# Altium project MB1261.PrjPcb (part 2 of 3)

## Sheet MCU.SchDoc: MCU
size A3; Author: P.A.; CompanyName: STMicroelectronics; Organization: Microcontrollers Division; Address1: 12, Rue Jules HOROWITZ; Address2: 38019 Grenoble; Address3: FRANCE; DocumentNumber: MB1261; Revision: B.01; SheetNumber: 11; SheetTotal: 15; Project: STM32L496G-DISCO
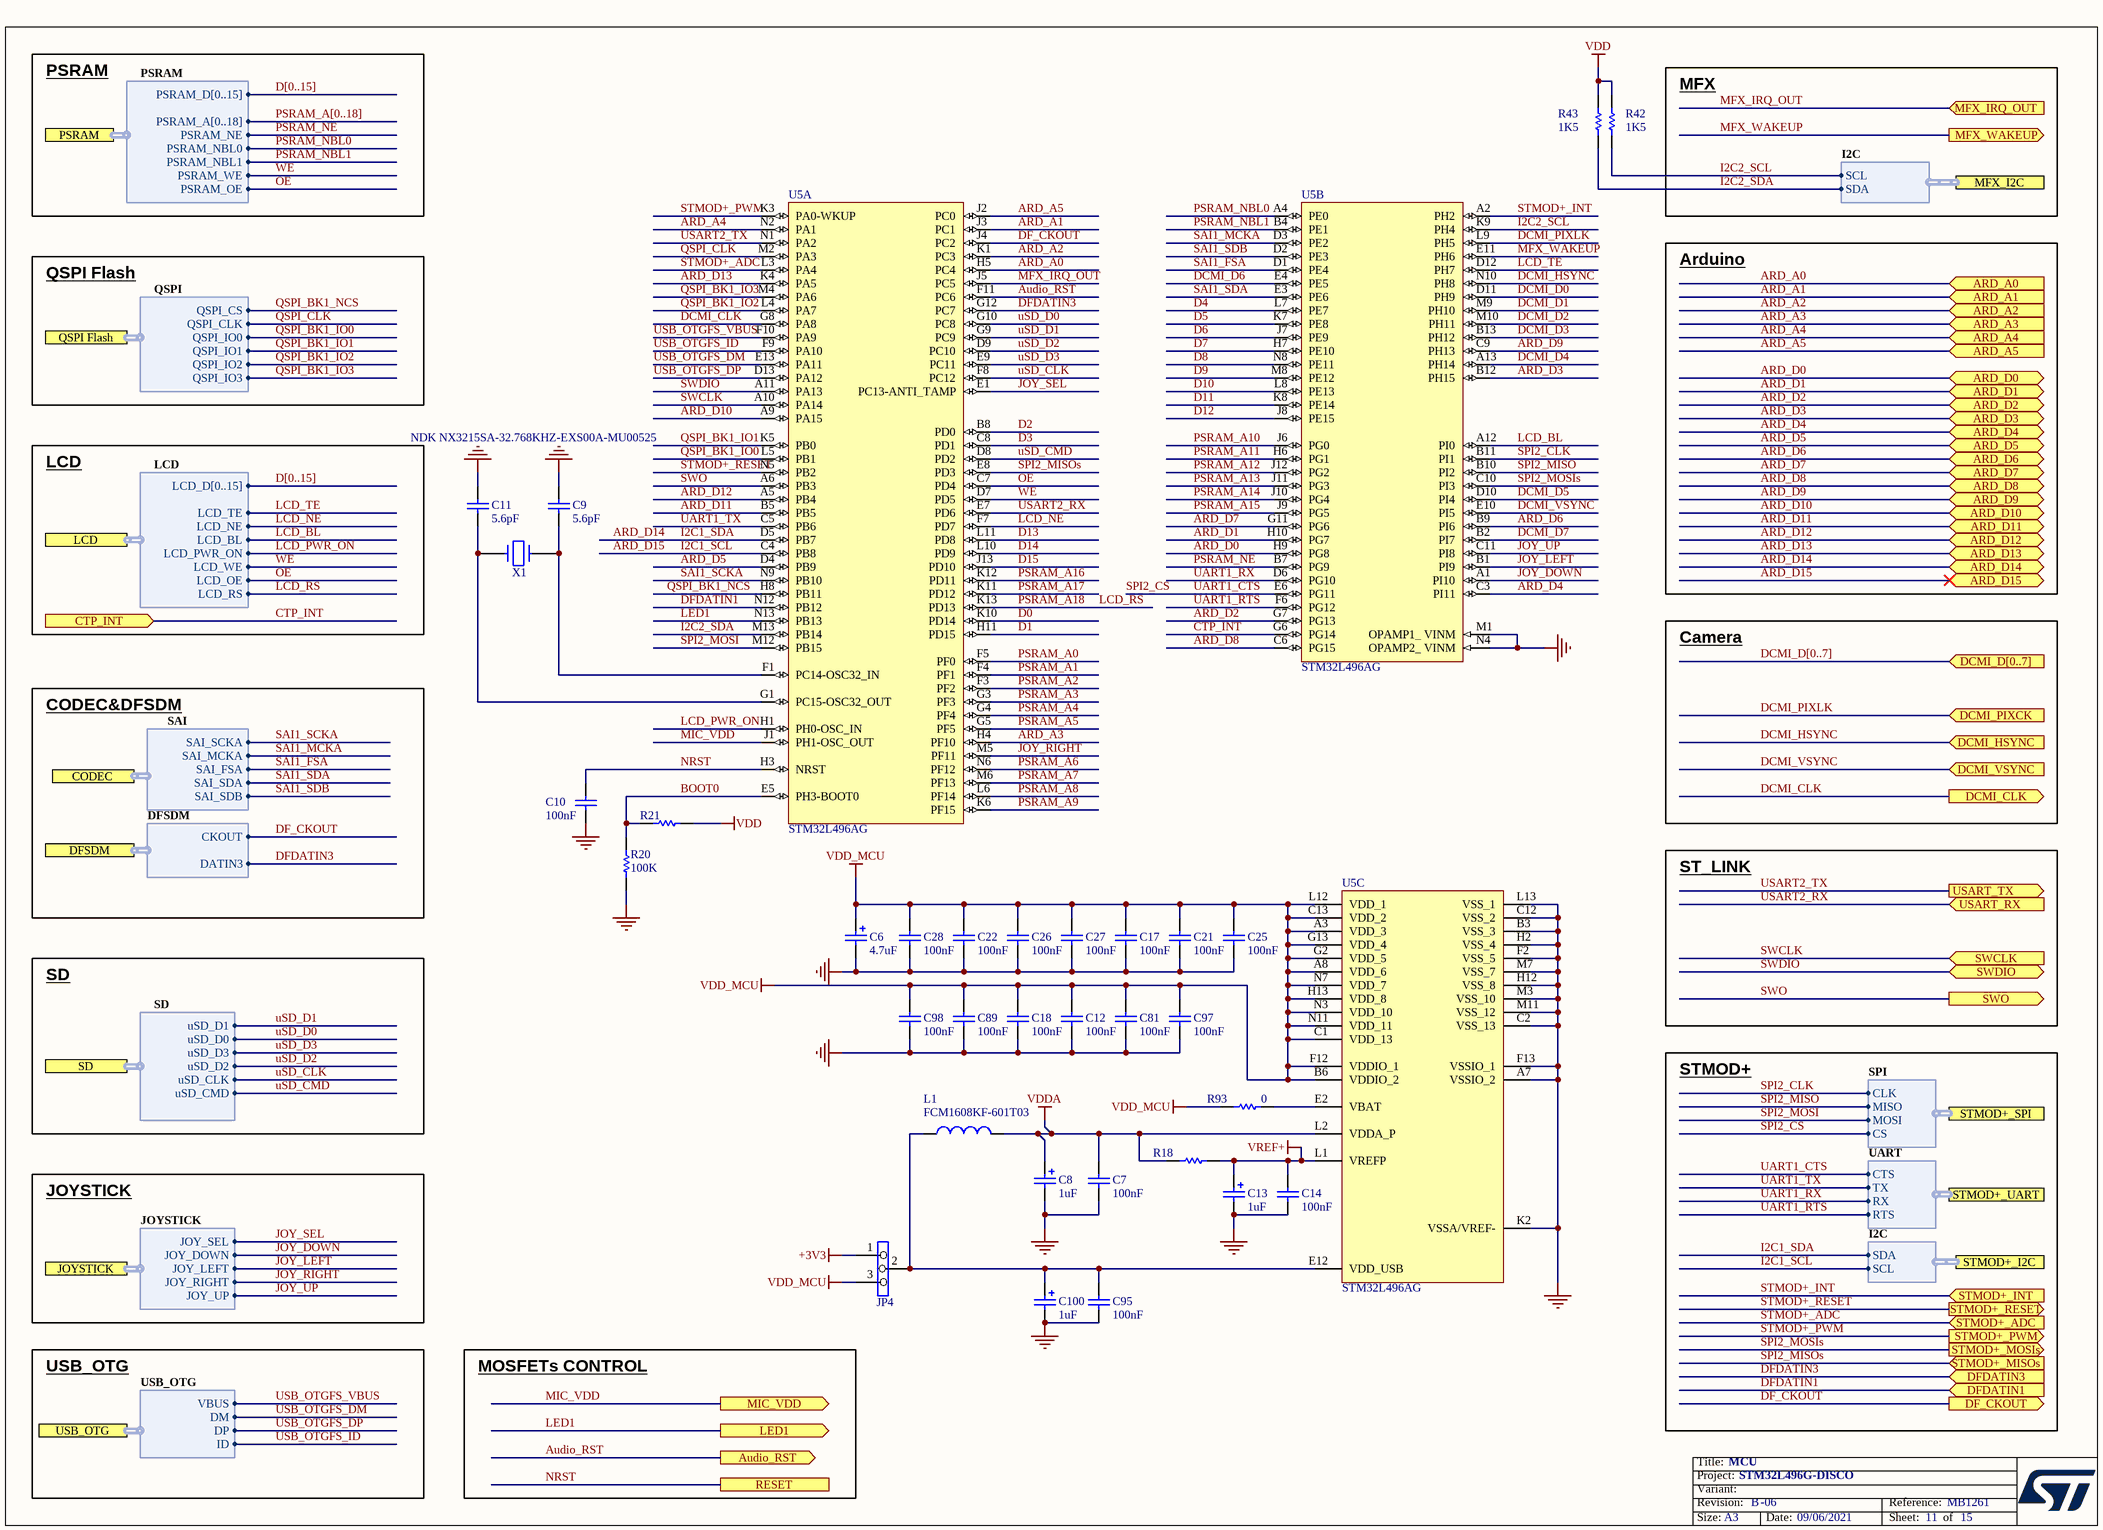
[diagram p6: MCU.SchDoc]

### Parts
C6  value 4.7uF  [TAN-A]  (hidden comment: TAJA475K016R)
C7  value 100nF  [0603C]  (hidden comment: CC0603KRX7R7BB104)
C8  value 1uF  [TAN-A]  (hidden comment: TAJA105K016R)
C9  5.6pF  [0603C]
C10  value 100nF  [0603C]  (hidden comment: CC0603KRX7R7BB104)
C11  5.6pF  [0603C]
C12  value 100nF  [0603C]  (hidden comment: CC0603KRX7R7BB104)
C13  value 1uF  [TAN-A]  (hidden comment: TAJA105K016R)
C14  value 100nF  [0603C]  (hidden comment: CC0603KRX7R7BB104)
C17  value 100nF  [0603C]  (hidden comment: CC0603KRX7R7BB104)
C18  value 100nF  [0603C]  (hidden comment: CC0603KRX7R7BB104)
C21  value 100nF  [0603C]  (hidden comment: CC0603KRX7R7BB104)
C22  value 100nF  [0603C]  (hidden comment: CC0603KRX7R7BB104)
C25  value 100nF  [0603C]  (hidden comment: CC0603KRX7R7BB104)
C26  value 100nF  [0603C]  (hidden comment: CC0603KRX7R7BB104)
C27  value 100nF  [0603C]  (hidden comment: CC0603KRX7R7BB104)
C28  value 100nF  [0603C]  (hidden comment: CC0603KRX7R7BB104)
C81  value 100nF  [0603C]  (hidden comment: CC0603KRX7R7BB104)
C89  value 100nF  [0603C]  (hidden comment: CC0603KRX7R7BB104)
C95  value 100nF  [0603C]  (hidden comment: CC0603KRX7R7BB104)
C97  value 100nF  [0603C]  (hidden comment: CC0603KRX7R7BB104)
C98  value 100nF  [0603C]  (hidden comment: CC0603KRX7R7BB104)
C100  value 1uF  [TAN-A]  (hidden comment: TAJA105K016R)
JP4  Jumper3  [SIP3]  (value not drawn)
L1  FCM1608KF-601T03  [0603L]
R18  (no value)  [0603R]
R20  value 100K  [0603R]  (hidden comment: RC0603FR-07100KL)
R21  (no value)  [0603R]
R42  value 1K5  [0603R]  (hidden comment: RC0603FR-071K5L)
R43  value 1K5  [0603R]  (hidden comment: RC0603FR-071K5L)
R93  value 0  [0603R]  (hidden comment: RC0603JR-070RL)
U5  STM32L496AG  [FBGA169_0R5_7X7]  (parts A,B,C of 3)
X1  NDK NX3215SA-32.768KHZ-EXS00A-MU00525  [XTAL_2SM_3R2X1R5]

### Ports
ARD_A0 (in), ARD_A1 (in), ARD_A2 (in), ARD_A3 (in), ARD_A4 (in), ARD_A5 (in), ARD_D0 (bidir), ARD_D1 (bidir), ARD_D2 (bidir), ARD_D3 (bidir), ARD_D4 (bidir), ARD_D5 (bidir), ARD_D6 (bidir), ARD_D7 (bidir), ARD_D8 (bidir), ARD_D9 (bidir), ARD_D10 (bidir), ARD_D11 (bidir), ARD_D12 (bidir), ARD_D13 (bidir), ARD_D14 (bidir), ARD_D15 (bidir), Audio_RST (out), CODEC (harness SAI), CTP_INT (in), DCMI_CLK (out), DCMI_D[0..7] (in), DCMI_HSYNC (in), DCMI_PIXCK (in), DCMI_VSYNC (in), DF_CKOUT (out), DFDATIN1 (in), DFDATIN3 (in), DFSDM (harness DFSDM), JOYSTICK (harness JOYSTICK), LCD (harness LCD), LED1 (out), MFX_I2C (harness I2C), MFX_IRQ_OUT (in), MFX_WAKEUP (out), MIC_VDD (out), PSRAM (harness PSRAM), QSPI Flash (harness QSPI), RESET, SD (harness SD), STMOD+_ADC (in), STMOD+_I2C (harness I2C), STMOD+_INT (in), STMOD+_MISOs (in), STMOD+_MOSIs (out), STMOD+_PWM (out), STMOD+_RESET (out), STMOD+_SPI (harness SPI), STMOD+_UART (harness UART), SWCLK (in), SWDIO (bidir), SWO (out), USART_RX (in), USART_TX (out), USB_OTG (harness USB_OTG)

### Harnesses
QSPI: QSPI_IO1, QSPI_IO0, QSPI_CLK, QSPI_CS, QSPI_IO2, QSPI_IO3
PSRAM: PSRAM_A[0..18], PSRAM_NE, PSRAM_NBL0, PSRAM_WE, PSRAM_OE, PSRAM_D[0..15], PSRAM_NBL1
LCD: LCD_NE, LCD_BL, LCD_WE, LCD_OE, LCD_D[0..15], LCD_RS, LCD_PWR_ON, LCD_TE
SAI: SAI_SDB, SAI_FSA, SAI_MCKA, SAI_SDA, SAI_SCKA
DFSDM: DATIN3, CKOUT
SD: uSD_D0, uSD_CLK, uSD_D1, uSD_D2, uSD_D3, uSD_CMD
JOYSTICK: JOY_SEL, JOY_DOWN, JOY_LEFT, JOY_RIGHT, JOY_UP
USB_OTG: VBUS, DM, DP, ID
I2C: SDA, SCL
SPI: MISO, MOSI, CLK, CS
UART: RX, TX, RTS, CTS

### Nets
+3V3: JP4.1  [project net 3V3_OUT]
GND: C6.2 C7.2 C8.2 C9.1 C10.2 C11.1 C12.2 C13.2 C14.2 C17.2 C18.2 C21.2 C22.2 C25.2 C26.2 C27.2 C28.2 C81.2 C89.2 C95.2 C97.2 C98.2 C100.2 R20.1 U5.A7(VSSIO_2) U5.B3(VSS_3) U5.C2(VSS_13) U5.C12(VSS_2) U5.F2(VSS_5) U5.F13(VSSIO_1) U5.H2(VSS_4) U5.H12(VSS_8) U5.K2(VSSA/VREF-) U5.L13(VSS_1) U5.M1(OPAMP1__VINM) U5.M3(VSS_10) U5.M7(VSS_7) U5.M11(VSS_12) U5.N4(OPAMP2__VINM)
VDD: R21.1 R42.1 R43.1
VDD_MCU: C6.1 C12.1 C17.1 C18.1 C21.1 C22.1 C25.1 C26.1 C27.1 C28.1 C81.1 C89.1 C97.1 C98.1 JP4.3 R93.2 U5.A3(VDD_3) U5.A8(VDD_6) U5.B6(VDDIO_2) U5.C1(VDD_13) U5.C13(VDD_2) U5.F12(VDDIO_1) U5.G2(VDD_5) U5.G13(VDD_4) U5.H13(VDD_8) U5.L12(VDD_1) U5.N3(VDD_10) U5.N7(VDD_7) U5.N11(VDD_11)
VDDA: C7.1 C8.1 L1.2 R18.2 U5.L2(VDDA_P)
VREF+: C13.1 C14.1 R18.1 U5.L1(VREFP)
ARD_A0: U5.H5(PC4) ; port ARD_A0
ARD_A1: U5.J3(PC1) ; port ARD_A1
ARD_A2: U5.K1(PC3) ; port ARD_A2
ARD_A3: U5.H4(PF10) ; port ARD_A3
ARD_A4: U5.N2(PA1) ; port ARD_A4
ARD_A5: U5.J2(PC0) ; port ARD_A5
ARD_D0: U5.H9(PG8) ; port ARD_D0
ARD_D1: U5.H10(PG7) ; port ARD_D1
ARD_D2: U5.G7(PG13) ; port ARD_D2
ARD_D3: U5.B12(PH15) ; port ARD_D3
ARD_D4: U5.C3(PI11) ; port ARD_D4
ARD_D5: U5.D4(PB9) ; port ARD_D5
ARD_D6: U5.B9(PI6) ; port ARD_D6
ARD_D7: U5.G11(PG6) ; port ARD_D7
ARD_D8: U5.C6(PG15) ; port ARD_D8
ARD_D9: U5.C9(PH13) ; port ARD_D9
ARD_D10: U5.A9(PA15) ; port ARD_D10
ARD_D11: U5.B5(PB5) ; port ARD_D11
ARD_D12: U5.A5(PB4) ; port ARD_D12
ARD_D13: U5.K4(PA5) ; port ARD_D13
ARD_D14: U5.D5(PB7) ; port ARD_D14, port STMOD+_I2C.SDA  [also labelled I2C1_SDA]
ARD_D15: U5.C4(PB8) ; port ARD_D15, port STMOD+_I2C.SCL  [also labelled I2C1_SCL]
Audio_RST: U5.F11(PC6) ; port Audio_RST
BOOT0: R20.2 R21.2 U5.E5(PH3-BOOT0)
CTP_INT: U5.G6(PG14) ; port CTP_INT
D0: U5.K10(PD14)
D1: U5.H11(PD15)
D2: U5.B8(PD0)
D3: U5.C8(PD1)
D4: U5.L7(PE7)
D5: U5.K7(PE8)
D6: U5.J7(PE9)
D7: U5.H7(PE10)
D8: U5.N8(PE11)
D9: U5.M8(PE12)
D10: U5.L8(PE13)
D11: U5.K8(PE14)
D12: U5.J8(PE15)
D13: U5.L11(PD8)
D14: U5.L10(PD9)
D15: U5.J13(PD10)
DCMI_CLK: U5.G8(PA8) ; port DCMI_CLK
DCMI_D0: U5.D11(PH9)
DCMI_D1: U5.M9(PH10)
DCMI_D2: U5.M10(PH11)
DCMI_D3: U5.B13(PH12)
DCMI_D4: U5.A13(PH14)
DCMI_D5: U5.D10(PI4)
DCMI_D6: U5.E4(PE5)
DCMI_D7: U5.B2(PI7)
DCMI_HSYNC: U5.N10(PH8) ; port DCMI_HSYNC
DCMI_PIXLK: U5.L9(PH5) ; port DCMI_PIXCK  [project net DCMI_PIXCK]
DCMI_VSYNC: U5.E10(PI5) ; port DCMI_VSYNC
DF_CKOUT: U5.J4(PC2) ; port DF_CKOUT, port DFSDM.CKOUT  [project net CKOUT]
DFDATIN1: U5.N12(PB12) ; port DFDATIN1
DFDATIN3: U5.G12(PC7) ; port DFDATIN3, port DFSDM.DATIN3  [project net DATIN3]
I2C2_SCL: R42.2 U5.K9(PH4) ; port MFX_I2C.SCL
I2C2_SDA: R43.2 U5.M13(PB14) ; port MFX_I2C.SDA
JOY_DOWN: U5.A1(PI10) ; port JOYSTICK.JOY_DOWN
JOY_LEFT: U5.B1(PI9) ; port JOYSTICK.JOY_LEFT
JOY_RIGHT: U5.M5(PF11) ; port JOYSTICK.JOY_RIGHT
JOY_SEL: U5.E1(PC13-ANTI_TAMP) ; port JOYSTICK.JOY_SEL
JOY_UP: U5.C11(PI8) ; port JOYSTICK.JOY_UP
LCD_BL: U5.A12(PI0) ; port LCD.LCD_BL
LCD_NE: U5.F7(PD7) ; port LCD.LCD_NE
LCD_PWR_ON: U5.H1(PH0-OSC_IN) ; port LCD.LCD_PWR_ON
LCD_RS: U5.K13(PD13) ; port LCD.LCD_RS  [also labelled PSRAM_A18]
LCD_TE: U5.D12(PH7) ; port LCD.LCD_TE
LED1: U5.N13(PB13) ; port LED1
MFX_IRQ_OUT: U5.J5(PC5) ; port MFX_IRQ_OUT
MFX_WAKEUP: U5.E11(PH6) ; port MFX_WAKEUP
MIC_VDD: U5.J1(PH1-OSC_OUT) ; port MIC_VDD
NRST: C10.1 U5.H3(NRST) ; port RESET
OE: U5.C7(PD4) ; port PSRAM.PSRAM_OE, port LCD.LCD_OE  [project net LCD_OE]
PSRAM_A0: U5.F5(PF0)
PSRAM_A1: U5.F4(PF1)
PSRAM_A2: U5.F3(PF2)
PSRAM_A3: U5.G3(PF3)
PSRAM_A4: U5.G4(PF4)
PSRAM_A5: U5.G5(PF5)
PSRAM_A6: U5.N6(PF12)
PSRAM_A7: U5.M6(PF13)
PSRAM_A8: U5.L6(PF14)
PSRAM_A9: U5.K6(PF15)
PSRAM_A10: U5.J6(PG0)
PSRAM_A11: U5.H6(PG1)
PSRAM_A12: U5.J12(PG2)
PSRAM_A13: U5.J11(PG3)
PSRAM_A14: U5.J10(PG4)
PSRAM_A15: U5.J9(PG5)
PSRAM_A16: U5.K12(PD11)
PSRAM_A17: U5.K11(PD12)
PSRAM_NBL0: U5.A4(PE0) ; port PSRAM.PSRAM_NBL0
PSRAM_NBL1: U5.B4(PE1) ; port PSRAM.PSRAM_NBL1
PSRAM_NE: U5.B7(PG9) ; port PSRAM.PSRAM_NE
QSPI_BK1_IO0: U5.L5(PB1) ; port QSPI Flash.QSPI_IO0
QSPI_BK1_IO1: U5.K5(PB0) ; port QSPI Flash.QSPI_IO1
QSPI_BK1_IO2: U5.L4(PA7) ; port QSPI Flash.QSPI_IO2
QSPI_BK1_IO3: U5.M4(PA6) ; port QSPI Flash.QSPI_IO3
QSPI_BK1_NCS: U5.H8(PB11) ; port QSPI Flash.QSPI_CS
QSPI_CLK: U5.M2(PA3) ; port QSPI Flash.QSPI_CLK
SAI1_FSA: U5.D1(PE4) ; port CODEC.SAI_FSA
SAI1_MCKA: U5.D3(PE2) ; port CODEC.SAI_MCKA
SAI1_SCKA: U5.N9(PB10) ; port CODEC.SAI_SCKA
SAI1_SDA: U5.E3(PE6) ; port CODEC.SAI_SDA
SAI1_SDB: U5.D2(PE3) ; port CODEC.SAI_SDB
SPI2_CLK: U5.B11(PI1) ; port STMOD+_SPI.CLK
SPI2_CS: U5.E6(PG11) ; port STMOD+_SPI.CS, port STMOD+_UART.CTS  [also labelled UART1_CTS]  [project net PMOD#1]
SPI2_MISO: U5.B10(PI2) ; port STMOD+_SPI.MISO
SPI2_MISOs: U5.E8(PD3) ; port STMOD+_MISOs
SPI2_MOSI: U5.M12(PB15) ; port STMOD+_SPI.MOSI
SPI2_MOSIs: U5.C10(PI3) ; port STMOD+_MOSIs
STMOD+_ADC: U5.L3(PA4) ; port STMOD+_ADC
STMOD+_INT: U5.A2(PH2) ; port STMOD+_INT  [project net PMOD#11]
STMOD+_PWM: U5.K3(PA0-WKUP) ; port STMOD+_PWM
STMOD+_RESET: U5.N5(PB2) ; port STMOD+_RESET  [project net PMOD#12]
SWCLK: U5.A10(PA14) ; port SWCLK
SWDIO: U5.A11(PA13) ; port SWDIO
SWO: U5.A6(PB3) ; port SWO
UART1_RTS: U5.F6(PG12) ; port STMOD+_UART.RTS
UART1_RX: U5.D6(PG10) ; port STMOD+_UART.RX
UART1_TX: U5.C5(PB6) ; port STMOD+_UART.TX
USART2_RX: U5.E7(PD6) ; port USART_RX
USART2_TX: U5.N1(PA2) ; port USART_TX
USB_OTGFS_DM: U5.E13(PA11) ; port USB_OTG.DM  [project net D_N]
USB_OTGFS_DP: U5.D13(PA12) ; port USB_OTG.DP  [project net D_P]
USB_OTGFS_ID: U5.F9(PA10) ; port USB_OTG.ID
USB_OTGFS_VBUS: U5.F10(PA9) ; port USB_OTG.VBUS
uSD_CLK: U5.F8(PC12) ; port SD.uSD_CLK
uSD_CMD: U5.D8(PD2) ; port SD.uSD_CMD
uSD_D0: U5.G10(PC8) ; port SD.uSD_D0
uSD_D1: U5.G9(PC9) ; port SD.uSD_D1
uSD_D2: U5.D9(PC10) ; port SD.uSD_D2
uSD_D3: U5.E9(PC11) ; port SD.uSD_D3
WE: U5.D7(PD5) ; port PSRAM.PSRAM_WE, port LCD.LCD_WE  [project net LCD_WE]
NetC9_2: C9.2 U5.F1(PC14-OSC32_IN) X1.1
NetC11_2: C11.2 U5.G1(PC15-OSC32_OUT) X1.2
NetC95_1: C95.1 C100.1 JP4.2 L1.1 U5.E12(VDD_USB)
NetR93_1: R93.1 U5.E2(VBAT)

### Buses and harness runs
bus D[0..15]
bus DCMI_D[0..7] = port DCMI_D[0..7]
bus PSRAM_A[0..18]

### Notes on the sheet
- PSRAM
- MFX
- Arduino
- QSPI Flash
- LCD
- Camera
- CODEC&DFSDM
- ST_LINK
- SD
- STMOD+
- JOYSTICK
- USB_OTG
- MOSFETs CONTROL
- Title:
- Project:
- Size:
- Revision:
- Variant:
- A3
- -
- Date:
- Reference:
- Sheet:
- of

### Library data of the parts
C6 = Cap Pol1: TAN Capacitor,4.7uF,10%,16V,A Type,AVX; Ordered by: Subcon; ECCN_US/EU: NA; Published: 8-Jun-2000; Revision: July-2002: Re-released for DXP Platform.; Publisher: Altium Limited; Manuf_1: AVX; Manuf_Part_1: TAJA475K016R
C7 C10 C12 C14 C17 C18 C21 C22 C25-C28 C81 C89 C95 C97 C98 = Cap: as C60 on sheet Camera; Published: 8-Jun-2000; Revision: July-2002: Re-released for DXP Platform.; Publisher: Altium Limited; Manuf_1: YAGEO; Manuf_Part_1: CC0603KRX7R7BB104
C8 C13 C100 = Cap Pol1: Tan Capacitor,1uF,10%,16V,Tan-A,TAJA105K016R; Manuf_1: AVX; Ordered by: Subcon; ECCN_US/EU: NA; Published: 8-Jun-2000; Revision: July-2002: Re-released for DXP Platform.; Publisher: Altium Limited; Manuf_Part_1: TAJA105K016R
C9 C11 = Cap: Capacitor,5.6pF,0.25P,50V,NPO,0603; Manuf_1: YAGEO; Ordered by: Subcon; Published: 8-Jun-2000; Revision: July-2002: Re-released for DXP Platform.; Publisher: Altium Limited; Value: 5.6pF
JP4 = Jumper3: Manuf_1: lyconn; Manuf_Part_1: 313103S111116; Ordered by: Subcon; ECCN_US/EU: NA
L1 = Inductor: 100uH Bead; Manuf_1: Tai-tech; Ordered by: Subcon; ECCN_US/EU: NA; Published: 8-Jun-2000; Revision: July-2002: Re-released for DXP Platform.; Publisher: Altium Limited; Value: 100uH; Manuf_Part_1: FCM1608KF-601T03
R18 = res1: Resistor, 0 ,0603,1%,YAGEO; Manuf_Part_1: RC0603JR-070RL; Value: 0; Ordered by: Subcon; ECCN_US/EU: NA; Published: 8-Jun-2000; Revision: July-2002: Re-released for DXP Platform.; Publisher: Altium Limited; Manuf_1: YAGEO
R20 = res1: as R84 on sheet IDD_measurement; Published: 8-Jun-2000; Revision: July-2002: Re-released for DXP Platform.; Publisher: Altium Limited; Manuf_1: YAGEO; Manuf_Part_1: RC0603FR-07100KL
R21 = res1: Resistor,100K,0603,1%,YAGEO; Manuf_Part_1: RC0603FR-07100KL; Ordered by: Subcon; ECCN_US/EU: NA; Published: 8-Jun-2000; Revision: July-2002: Re-released for DXP Platform.; Publisher: Altium Limited; Value: 100K; Manuf_1: YAGEO
R42 R43 = res1: Resistor,1.5K,0603,1%,YAGEO; Ordered by: Subcon; ECCN_US/EU: NA; Published: 8-Jun-2000; Revision: July-2002: Re-released for DXP Platform.; Publisher: Altium Limited; Manuf_1: YAGEO; Manuf_Part_1: RC0603FR-071K5L
R93 = res1: as R105 on sheet IDD_measurement; Published: 8-Jun-2000; Revision: July-2002: Re-released for DXP Platform.; Publisher: Altium Limited; Manuf_1: YAGEO; Manuf_Part_1: RC0603JR-070RL
U5 = STM32L496G: Ordered by: STM; Ref St: TBD; ECCN_US/EU: 3A991A2/NEC; Manuf_1: STM; Manuf_Part_1: STM32L496AG
X1 = CRYSTAL_32K: 32.768kHz Crystal; Ordered by: STM; ECCN_US/EU: EAR99/NEC; Ref St: 9157034; Manuf_1: NDK; Manuf_Part_1: NX3215SA-32.768KHZ-EXS00A-MU00525

## Sheet Peripherals.SchDoc: Peripherals
size A4; Author: P.A.; CompanyName: STMicroelectronics; Organization: Microcontrollers Division; Address1: 12, Rue Jules HOROWITZ; Address2: 38019 Grenoble; Address3: FRANCE; DocumentNumber: MB1261; Revision: B.01; SheetNumber: 7; SheetTotal: 15; Project: STM32L496G-DISCO
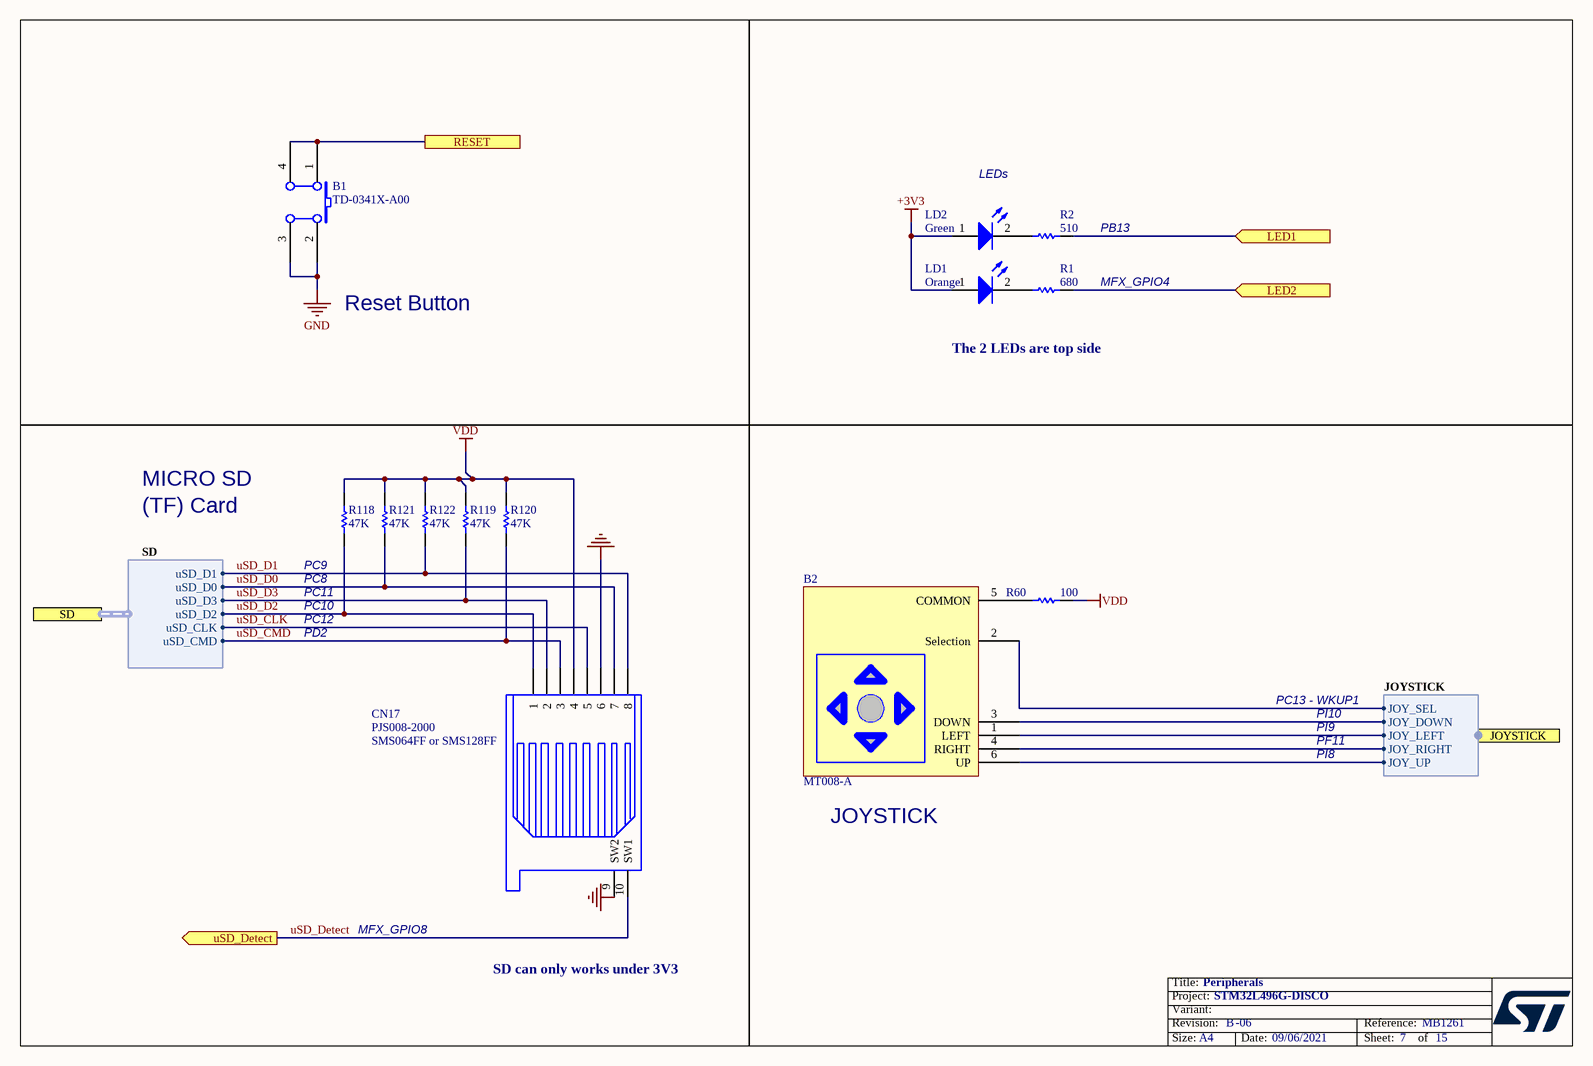
[diagram p7: Peripherals.SchDoc]

### Parts
B1  TD-0341X-A00  [PB10]
B2  MT008-A  [MT-008A]
CN17  PJS008-2000  [MSD_PJS008_]
LD1  Corlor: Orange  [0603D]  (hidden comment: 19-217/S2C-AM2N2VY/3T)
LD2  Corlor: Green  [0603D]  (hidden comment: 19-213SY6C/S530-E2/TR8LED)
R1  value 680  [0603R]  (hidden comment: RC0603FR-07680RL)
R2  value 510  [0603R]  (hidden comment: RC0603FR-07510RL)
R60  value 100  [0603R]  (hidden comment: RC0603JR-07100RL)
R118  47K  [0603R]
R119  47K  [0603R]
R120  47K  [0603R]
R121  47K  [0603R]
R122  47K  [0603R]

### Ports
JOYSTICK (harness JOYSTICK), LED1 (in), LED2 (in), RESET, SD (harness SD), uSD_Detect (out)

### Harnesses
SD: uSD_D0, uSD_CLK, uSD_D1, uSD_D2, uSD_D3, uSD_CMD
JOYSTICK: JOY_SEL, JOY_DOWN, JOY_LEFT, JOY_RIGHT, JOY_UP

### Nets
+3V3: LD1.1(A) LD2.1(A)  [project net 3V3_OUT]
GND: B1.2(B0) B1.3(B1) CN17.6 CN17.9(SW2)
VDD: CN17.4 R60.1 R118.2 R119.2 R120.2 R121.2 R122.2
JOY_DOWN: B2.3(DOWN) ; port JOYSTICK.JOY_DOWN
JOY_LEFT: B2.1(LEFT) ; port JOYSTICK.JOY_LEFT
JOY_RIGHT: B2.4(RIGHT) ; port JOYSTICK.JOY_RIGHT
JOY_SEL: B2.2(Selection) ; port JOYSTICK.JOY_SEL
JOY_UP: B2.6(UP) ; port JOYSTICK.JOY_UP
LED1: R2.1 ; port LED1
NRST: B1.1(A0) B1.4(A1) ; port RESET
uSD_CLK: CN17.5 ; port SD.uSD_CLK
uSD_CMD: CN17.3 R120.1 ; port SD.uSD_CMD
uSD_D0: CN17.7 R121.1 ; port SD.uSD_D0
uSD_D1: CN17.8 R122.1 ; port SD.uSD_D1
uSD_D2: CN17.1 R118.1 ; port SD.uSD_D2
uSD_D3: CN17.2 R119.1 ; port SD.uSD_D3
uSD_Detect: CN17.10(SW1) ; port uSD_Detect
NetB2_5: B2.5(COMMON) R60.2
NetLD1_2: LD1.2(K) R1.2
NetLD2_2: LD2.2(K) R2.2
NetR1_1: R1.1 ; port LED2

### Notes on the sheet
- LEDs
- (near R2) PB13
- Reset Button
- MFX_GPIO4
- The 2 LEDs are top side
- MICRO SD
- (TF) Card
- (near R118) PC8
- (near R118) PC9
- PC11
- PC10
- PC12
- PD2
- PC13 - WKUP1
- PI9
- PI10
- (near CN17) SMS064FF or SMS128FF
- PF11
- PI8
- JOYSTICK
- MFX_GPIO8
- SD can only works under 3V3
- Title:
- Project:
- Size:
- Revision:
- Variant:
- A4
- -
- Date:
- Reference:
- Sheet:
- of

### Library data of the parts
B1 = SW PUSHBUTTON: SE Push Button TD-0341 [RESET/Black]; Manuf_1: Chau-hua; Manuf_Part_1: CTSM-644N-V-T/R; Manuf_2: wealthmetal; Ordered by: Subcon; Assembly: with Back cap; Silkscreen: RESET; ECCN_US/EU: NA; Manuf_Part_2: TD-0341X-A00
B2 = MT-008A: Joystick; Manuf_1: XIEJIA; Ordered by: Subcon; Assembly: with button; ECCN_US/EU: NA; Silkscreen: Joystick; Manuf_Part_1: MT008-A
CN17 = SMS016AFA5E: Manuf_1: Yamaichi; Ordered by: Subcon; Silkscreen: uSD; ECCN_US/EU: NA; Manuf_Part_1: PJS008-2000
LD1 = LED2: LED,Orange,0603; Manuf_1: Everlight; Ordered by: Subcon; ECCN_US/EU: EAR99/NEC; Published: 8-Jun-2000; Revision: July-2002: Re-released for DXP Platform.; Publisher: Altium Limited; Manuf_Part_1: 19-217/S2C-AM2N2VY/3T
LD2 = LED2: as LD3 on sheet Arduino_ Connectors; Published: 8-Jun-2000; Revision: July-2002: Re-released for DXP Platform.; Publisher: Altium Limited; Manuf_Part_1: 19-213SY6C/S530-E2/TR8LED
R1 = res1: Resistor,680R,0603,1%,YAGEO; Ordered by: Subcon; ECCN_US/EU: NA; Published: 8-Jun-2000; Revision: July-2002: Re-released for DXP Platform.; Publisher: Altium Limited; Manuf_1: YAGEO; Manuf_Part_1: RC0603FR-07680RL
R2 = res1: Resistor,510R,0603,1%,YAGEO; Ordered by: Subcon; ECCN_US/EU: NA; Published: 8-Jun-2000; Revision: July-2002: Re-released for DXP Platform.; Publisher: Altium Limited; Manuf_1: YAGEO; Manuf_Part_1: RC0603FR-07510RL
R60 = res1: as R102 on sheet IDD_measurement; Published: 8-Jun-2000; Revision: July-2002: Re-released for DXP Platform.; Publisher: Altium Limited; Manuf_1: YAGEO; Manuf_Part_1: RC0603JR-07100RL
R118-R122 = res1: Resistor,47K,0603,1%,YAGEO; Manuf_Part_1: RC0603FR-0747KL; Ordered by: Subcon; ECCN_US/EU: NA; Published: 8-Jun-2000; Revision: July-2002: Re-released for DXP Platform.; Publisher: Altium Limited; Value: 47K; Manuf_1: YAGEO

## Sheet Power.SchDoc: Power
size A4; Author: P.A.; CompanyName: STMicroelectronics; Organization: Microcontrollers Division; Address1: 12, Rue Jules HOROWITZ; Address2: 38019 Grenoble; Address3: FRANCE; DocumentNumber: MB1261; Revision: B.01; SheetNumber: 3; SheetTotal: 15; Project: STM32L496G-DISCO
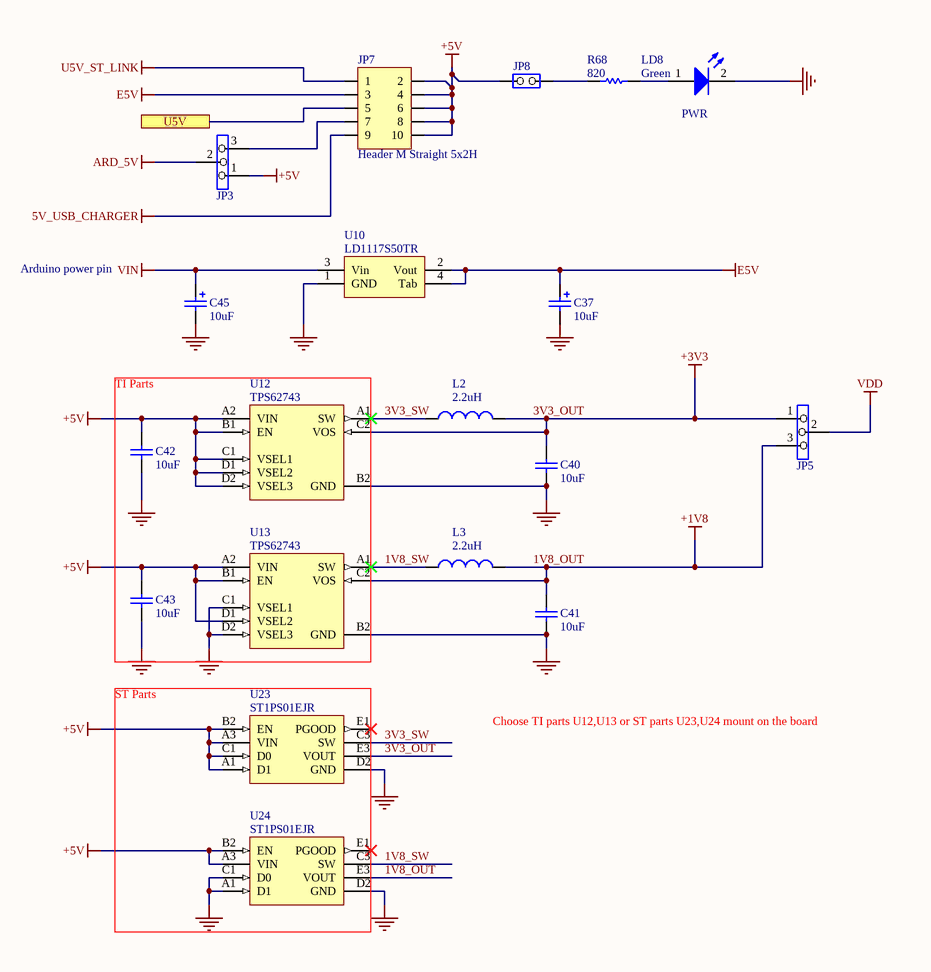
[diagram p8: Power.SchDoc]

### Parts
C37  value 10uF  [TAN-A]  (hidden comment: TAJA106K016R)
C40  value 10uF  [0402C]  (hidden comment: GRM155R60J106ME11)
C41  value 10uF  [0402C]  (hidden comment: GRM155R60J106ME11)
C42  value 10uF  [0402C]  (hidden comment: GRM155R60J106ME11)
C43  value 10uF  [0402C]  (hidden comment: GRM155R60J106ME11)
C45  value 10uF  [TAN-B]  (hidden comment: TAJB106K025RNJ)
JP3  3 PIN Jumper  [SIP3]  (value not drawn)
JP5  3 PIN Jumper  [SIP3]  (value not drawn)
JP7  Header M Straight 5x2H  [HDR_2X5_2R54]
JP8  2 PIN Jumper  [SIP2]  (value not drawn)
L2  2.2uH  [L1008_L0805_CPT]
L3  2.2uH  [L1008_L0805_CPT]
LD8  Silkscreen: PWR  Corlor: Green  [0603D]  (hidden comment: 19-213SY6C/S530-E2/TR8LED)
R68  820  [0603R]
U10  LD1117S50TR  [SOT-223]
U12  TPS62743  [BGA8_0R4_0R9X1R6]
U13  TPS62743  [BGA8_0R4_0R9X1R6]
U23  ST1PS01EJR  [BGA8_0R312-0R25_1R11X1R41]
U24  ST1PS01EJR  [BGA8_0R312-0R25_1R11X1R41]

### Blocks framed on the sheet
TI Parts: C42 C43 U12 U13
ST Parts: U23 U24

### Ports
U5V

### Nets
1V8_OUT: C41.1 JP5.3 L3.2 U13.C2(VOS) U24.E3(VOUT)  [also labelled +1V8]
3V3_OUT: C40.1 JP5.1 L2.2 U12.C2(VOS) U23.E3(VOUT)  [also labelled +3V3]
5V_USB_CHARGER: JP7.9
+5V: C42.1 C43.1 JP3.1 JP7.2 JP7.4 JP7.6 JP7.8 JP7.10 JP8.1(COMMON) U12.A2(VIN) U12.B1(EN) U12.C1(VSEL1) U12.D1(VSEL2) U12.D2(VSEL3) U13.A2(VIN) U13.B1(EN) U13.D1(VSEL2) U23.A1(D1) U23.A3(VIN) U23.B2(EN) U23.C1(D0) U24.A3(VIN) U24.B2(EN)
ARD_5V: JP3.2
E5V: C37.1 JP7.3 U10.2(Vout) U10.4(Tab)
GND: C37.2 C40.2 C41.2 C42.2 C43.2 C45.2 LD8.2(K) U10.1(GND) U12.B2(GND) U13.B2(GND) U13.C1(VSEL1) U13.D2(VSEL3) U23.D2(GND) U24.A1(D1) U24.C1(D0) U24.D2(GND)
U5V_ST_LINK: JP7.1
VDD: JP5.2
VIN: C45.1 U10.3(Vin)
1V8_SW: L3.1 U13.A1(SW) U24.C3(SW)
3V3_SW: L2.1 U12.A1(SW) U23.C3(SW)
USB_OTGFS_VBUS: JP7.5 ; port U5V
NetJP3_3: JP3.3 JP7.7
NetJP8_2: JP8.2(NO) R68.2
NetLD8_1: LD8.1(A) R68.1

Not connected (* = marked no-connect by the designer): U23 E1(PGOOD)*; U24 E1(PGOOD)*

### Notes on the sheet
- Arduino power pin
- Choose TI parts U12,U13 or ST parts U23,U24 mount on the board
- Title:
- Project:
- Size:
- Revision:
- Variant:
- A4
- -
- Date:
- Reference:
- Sheet:
- of

### Library data of the parts
C37 = Cap Pol1: TAN Capacitor,10uF,10%,16V,A Type,AVX; Ordered by: Subcon; ECCN_US/EU: NA; Published: 8-Jun-2000; Revision: July-2002: Re-released for DXP Platform.; Publisher: Altium Limited; Manuf_1: AVX; Manuf_Part_1: TAJA106K016R
C40-C43 = Cap: Capacitor,10uF,0402,GRM155R60J106ME11; Manuf_1: Murata; Ordered by: Subcon; Published: 8-Jun-2000; Revision: July-2002: Re-released for DXP Platform.; Publisher: Altium Limited; Manuf_Part_1: GRM155R60J106ME11
C45 = Cap Pol1: Tan Capacitor,10uF,10%,25V,Tan-B,TAJB106K025RNJ; Manuf_1: AVX; Ordered by: Subcon; ECCN_US/EU: NA; Published: 8-Jun-2000; Revision: July-2002: Re-released for DXP Platform.; Publisher: Altium Limited; Manuf_Part_1: TAJB106K025RNJ
JP3 JP5 = Jumper3: Manuf_1: lyconn; Manuf_Part_1: 313103S111116; Ordered by: Subcon; Silkscreen: +3V3: pins 1&2 +1V8: pins 2&3; ECCN_US/EU: NA
JP7 = Header 5X2M: Pin Header male,2.54mm,2*5,L=11.6,180,1U,DIP; Manuf_1: Lyconn; Ordered by: Subcon; Distrib: Sub Co; Footprint: HDR2X5H; ECCN_US/EU: n/a; SOFER_FP: HDR_2X5_2R54
JP8 = JP2: Manuf_1: lyconn; Manuf_Part_1: 313102S111116; Ordered by: Subcon; Assembly: with jumper; ECCN_US/EU: NA
L2 L3 = Inductor: Manuf_1: TDK; Manuf_Part_1: VLS252010HBX-2R2M-1; Ordered by: Subcon; ECCN_US/EU: NA; Published: 8-Jun-2000; Revision: July-2002: Re-released for DXP Platform.; Publisher: Altium Limited; Value: 2.2uH
LD8 = LED2: LED,Green,0603; Manuf_1: Everlight; Ordered by: Subcon; ECCN_US/EU: EAR99/NEC; Published: 8-Jun-2000; Revision: July-2002: Re-released for DXP Platform.; Publisher: Altium Limited; Manuf_Part_1: 19-213SY6C/S530-E2/TR8LED
R68 = res1: Resistor; Manuf_1: YAGEO; Manuf_Part_1: RC0603FR-07820RL; Ordered by: Subcon; ECCN_US/EU: NA; Published: 8-Jun-2000; Revision: July-2002: Re-released for DXP Platform.; Publisher: Altium Limited; Value: 820
U10 = LD1117S18TR: Adjustable and fixed low drop positive voltage regulator; Ordered by: STM; Manuf_1: STM; Manuf_Part_1: LD1117S50TR
U12 U13 = TPS62743: High Efficiency Buck Converter; Manuf_1: TI; Ordered by: Subcon; ECCN_US/EU: N/A; Manuf_Part_1: TPS62743
U23 = ST1PS01EJR: 400mA NanoQuiescent Step Down converter; Manuf_1: STM; Manuf_Part_1: ST1PS01EJR; Ordered by: STM
U24 = ST1PS01EJR: 400mA NanoQuiescent Step Down converter; Ordered by: STM; Manuf_1: STM; Manuf_Part_1: ST1PS01EJR

## Sheet PSRAM.SchDoc: PSRAM
size A4; Author: P.A.; CompanyName: STMicroelectronics; Organization: Microcontrollers Division; Address1: 12, Rue Jules HOROWITZ; Address2: 38019 Grenoble; Address3: FRANCE; DocumentNumber: MB1261; Revision: B.01; SheetNumber: 12; SheetTotal: 15; Project: STM32L496G-DISCO
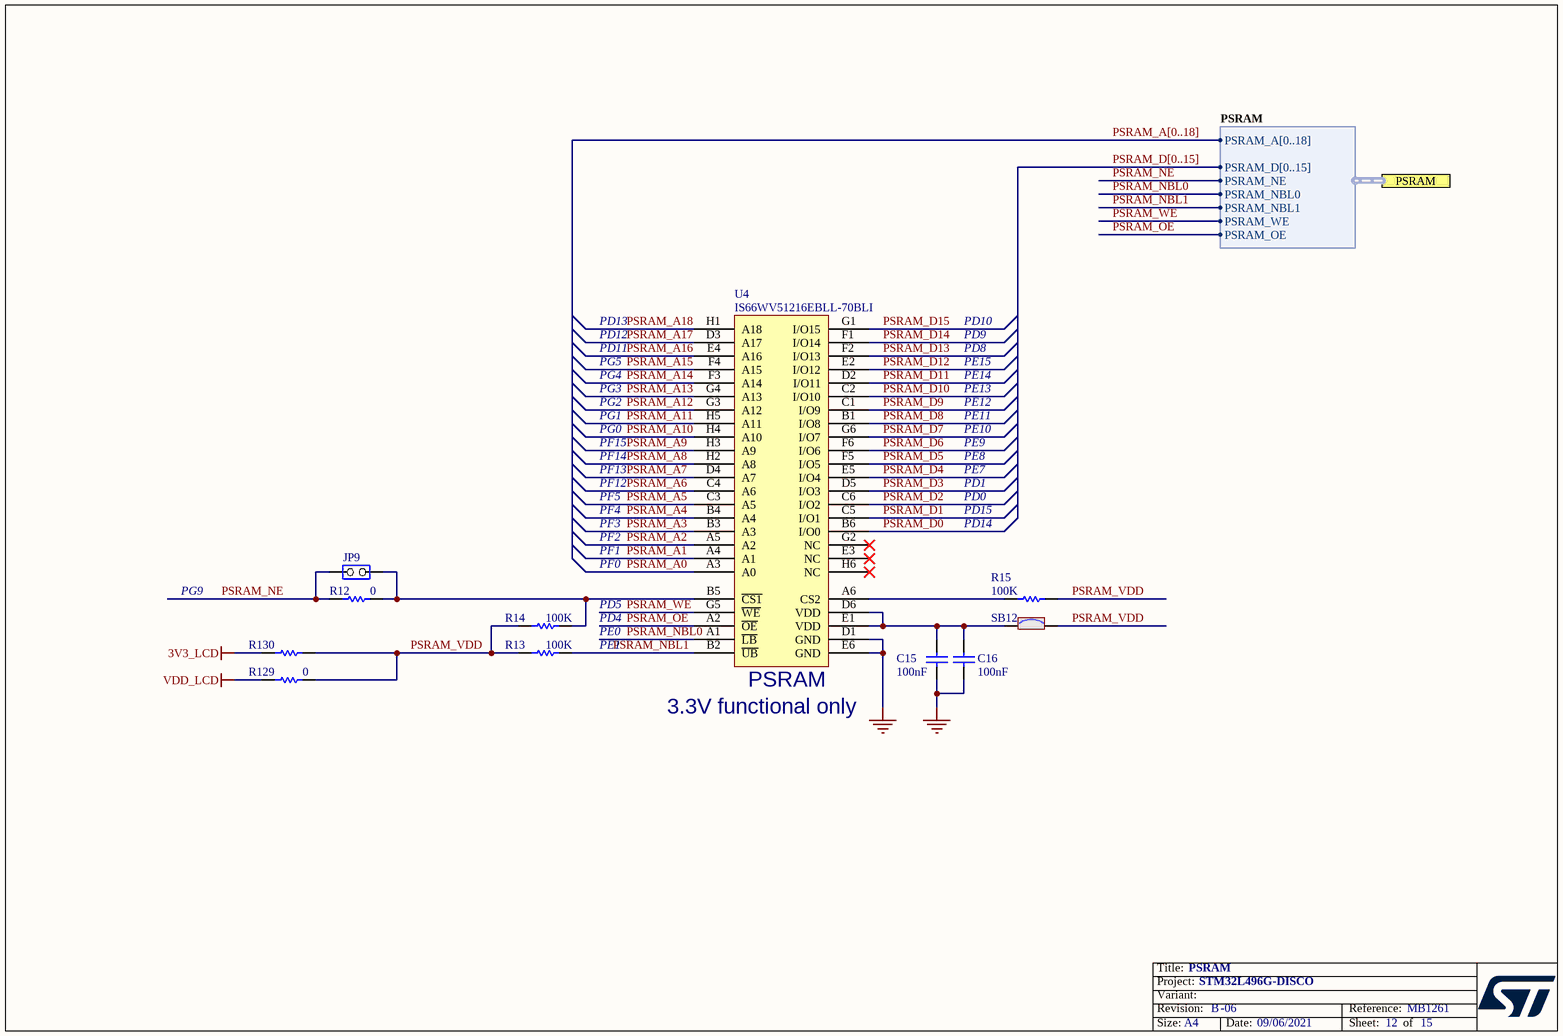
[diagram p9: PSRAM.SchDoc]

### Parts
C15  value 100nF  [0603C]  (hidden comment: CC0603KRX7R7BB104)
C16  value 100nF  [0603C]  (hidden comment: CC0603KRX7R7BB104)
JP9  2 PIN Jumper  [SIP2]  (value not drawn)
R12  0  [0603R]
R13  value 100K  [0603R]  (hidden comment: RC0603FR-07100KL)
R14  value 100K  [0603R]  (hidden comment: RC0603FR-07100KL)
R15  value 100K  [0603R]  (hidden comment: RC0603FR-07100KL)
R129  value 0  [0603R]  (hidden comment: RC0603JR-070RL)
R130  (no value)  [0603R]
SB12  Solder Bridge ON  [SB_0603]  (value not drawn)
U4  IS66WV51216EBLL-70BLI  [FBGA48_0R75_6X8]

### Ports
PSRAM (harness PSRAM)

### Harnesses
PSRAM: PSRAM_A[0..18], PSRAM_NE, PSRAM_NBL0, PSRAM_WE, PSRAM_OE, PSRAM_D[0..15], PSRAM_NBL1

### Nets
3V3_LCD: R130.2
GND: C15.2 C16.2 U4.D1(GND) U4.E6(GND)
VDD_LCD: R129.2
PSRAM_A0: U4.A3(A0)
PSRAM_A1: U4.A4(A1)
PSRAM_A2: U4.A5(A2)
PSRAM_A3: U4.B3(A3)
PSRAM_A4: U4.B4(A4)
PSRAM_A5: U4.C3(A5)
PSRAM_A6: U4.C4(A6)
PSRAM_A7: U4.D4(A7)
PSRAM_A8: U4.H2(A8)
PSRAM_A9: U4.H3(A9)
PSRAM_A10: U4.H4(A10)
PSRAM_A11: U4.H5(A11)
PSRAM_A12: U4.G3(A12)
PSRAM_A13: U4.G4(A13)
PSRAM_A14: U4.F3(A14)
PSRAM_A15: U4.F4(A15)
PSRAM_A16: U4.E4(A16)
PSRAM_A17: U4.D3(A17)
PSRAM_A18: U4.H1(A18)  [project net LCD_RS]
PSRAM_D0: U4.B6(I/O0)  [project net D0]
PSRAM_D1: U4.C5(I/O1)  [project net D1]
PSRAM_D2: U4.C6(I/O2)  [project net D2]
PSRAM_D3: U4.D5(I/O3)  [project net D3]
PSRAM_D4: U4.E5(I/O4)  [project net D4]
PSRAM_D5: U4.F5(I/O5)  [project net D5]
PSRAM_D6: U4.F6(I/O6)  [project net D6]
PSRAM_D7: U4.G6(I/O7)  [project net D7]
PSRAM_D8: U4.B1(I/O8)  [project net D8]
PSRAM_D9: U4.C1(I/O9)  [project net D9]
PSRAM_D10: U4.C2(I/O10)  [project net D10]
PSRAM_D11: U4.D2(I/O11)  [project net D11]
PSRAM_D12: U4.E2(I/O12)  [project net D12]
PSRAM_D13: U4.F2(I/O13)  [project net D13]
PSRAM_D14: U4.F1(I/O14)  [project net D14]
PSRAM_D15: U4.G1(I/O15)  [project net D15]
PSRAM_NBL0: U4.A1(~{LB}) ; port PSRAM.PSRAM_NBL0
PSRAM_NBL1: R13.1 U4.B2(~{UB}) ; port PSRAM.PSRAM_NBL1
PSRAM_NE: JP9.1(COMMON) R12.2 ; port PSRAM.PSRAM_NE
PSRAM_OE: U4.A2(~{OE}) ; port PSRAM.PSRAM_OE  [project net LCD_OE]
PSRAM_VDD: R13.2 R14.2 R15.1 R129.1 R130.1 SB12.2
PSRAM_WE: U4.G5(~{WE}) ; port PSRAM.PSRAM_WE  [project net LCD_WE]
NetC15_1: C15.1 C16.1 SB12.1 U4.D6(VDD) U4.E1(VDD)
NetJP9_2: JP9.2(NO) R12.1 R14.1 U4.B5(~{CS1})
NetR15_2: R15.2 U4.A6(CS2)

Not connected (* = marked no-connect by the designer): U4 E3(NC)* G2(NC)* H6(NC)*

### Buses and harness runs
bus PSRAM_A[0..18]
bus PSRAM_D[0..15]

### Notes on the sheet
- PD11
- PD12
- PD13
- PG4
- PG5
- PE14
- PE15
- PD8
- PD9
- PD10
- PF15
- PG0
- PG1
- PG2
- PG3
- PE9
- PE10
- PE11
- PE12
- PE13
- PF4
- PF5
- PF12
- PF13
- PF14
- PD15
- PD0
- PD1
- PE7
- PE8
- PF0
- PF1
- PF2
- PF3
- PD14
- PG9
- PD5
- PD4
- PE0
- PE1
- 3.3V functional only
- (near U4) PSRAM
- Title:
- Project:
- Size:
- Revision:
- Variant:
- A4
- -
- Date:
- Reference:
- Sheet:
- of

### Library data of the parts
C15 C16 = Cap: Capacitor,100nF,10%,16V,X7R,0603,YAGEO; Ordered by: Subcon; Published: 8-Jun-2000; Revision: July-2002: Re-released for DXP Platform.; Publisher: Altium Limited; Manuf_1: YAGEO; Manuf_Part_1: CC0603KRX7R7BB104
JP9 = JP2: as JP8 on sheet Power
R12 = res1: Resistor, 0 ,0603,1%,YAGEO; Manuf_Part_1: RC0603JR-070RL; Ordered by: Subcon; ECCN_US/EU: NA; Published: 8-Jun-2000; Revision: July-2002: Re-released for DXP Platform.; Publisher: Altium Limited; Value: 0; Manuf_1: YAGEO
R13-R15 = res1: Resistor,100K,0603,1%,YAGEO; Ordered by: Subcon; ECCN_US/EU: NA; Published: 8-Jun-2000; Revision: July-2002: Re-released for DXP Platform.; Publisher: Altium Limited; Manuf_1: YAGEO; Manuf_Part_1: RC0603FR-07100KL
R129 = res1: Resistor, 0 ,0603,1%,YAGEO; Ordered by: Subcon; ECCN_US/EU: NA; Published: 8-Jun-2000; Revision: July-2002: Re-released for DXP Platform.; Publisher: Altium Limited; Manuf_1: YAGEO; Manuf_Part_1: RC0603JR-070RL
R130 = res1: Resistor, 0 ,0603,1%,YAGEO; Manuf_Part_1: RC0603JR-070RL; Value: 0; Ordered by: Subcon; ECCN_US/EU: NA; Published: 8-Jun-2000; Revision: July-2002: Re-released for DXP Platform.; Publisher: Altium Limited; Manuf_1: YAGEO
SB12 = SB_ON: Manuf_1: YAGEO; Manuf_Part_1: RC0603JR-070RL; Solder: YES; Ordered By: Subcon; Revision: July-2002: Re-released for DXP Platform.; ECCN_US/EU: N/A
U4 = IS66WV51216EBLL-70BLI: 8M Bit static RAMs organized as 512K words by  16 bits.; Manuf_1: ISSI; Ordered by: STM; Manuf_Part_1: IS66WV51216EBLL-70BLI

## Sheet QSPI.SchDoc: QSPI Flash
size A4; Author: P.A.; CompanyName: STMicroelectronics; Organization: Microcontrollers Division; Address1: 12, Rue Jules HOROWITZ; Address2: 38019 Grenoble; Address3: FRANCE; DocumentNumber: MB1261; Revision: B.01; SheetNumber: 6; SheetTotal: 15; Project: STM32L496G-DISCO
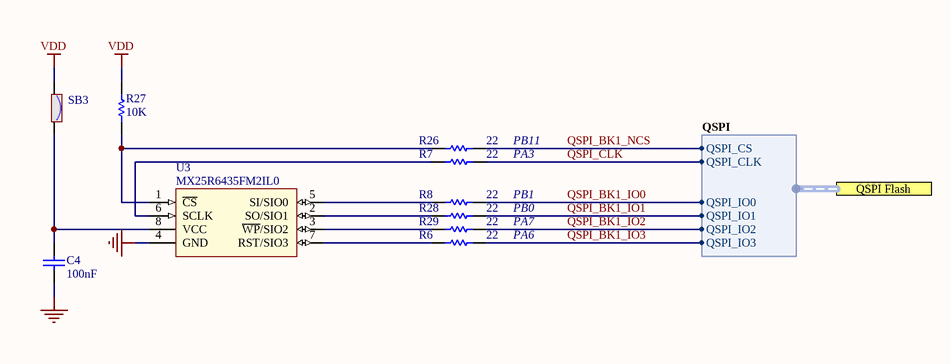
[diagram p10: QSPI.SchDoc]

### Parts
C4  value 100nF  [0603C]  (hidden comment: CC0603KRX7R7BB104)
R6  value 22  [0603R]  (hidden comment: RC0603JR-0722RL)
R7  value 22  [0603R]  (hidden comment: RC0603JR-0722RL)
R8  value 22  [0603R]  (hidden comment: RC0603JR-0722RL)
R26  value 22  [0603R]  (hidden comment: RC0603JR-0722RL)
R27  value 10K  [0603R]  (hidden comment: RC0603FR-0710KL)
R28  value 22  [0603R]  (hidden comment: RC0603JR-0722RL)
R29  value 22  [0603R]  (hidden comment: RC0603JR-0722RL)
SB3  Solder Bridge ON  [SB_0603]  (value not drawn)
U3  MX25R6435FM2IL0  [SOIC8_1R27_5R28X7R9]

### Ports
QSPI Flash (harness QSPI)

### Harnesses
QSPI: QSPI_IO1, QSPI_IO0, QSPI_CLK, QSPI_CS, QSPI_IO2, QSPI_IO3

### Nets
GND: C4.2 U3.4(GND)
VDD: R27.2 SB3.1
QSPI_BK1_IO0: R8.1 ; port QSPI Flash.QSPI_IO0
QSPI_BK1_IO1: R28.1 ; port QSPI Flash.QSPI_IO1
QSPI_BK1_IO2: R29.1 ; port QSPI Flash.QSPI_IO2
QSPI_BK1_IO3: R6.1 ; port QSPI Flash.QSPI_IO3
QSPI_BK1_NCS: R26.1 ; port QSPI Flash.QSPI_CS
QSPI_CLK: R7.1 ; port QSPI Flash.QSPI_CLK
NetC4_1: C4.1 SB3.2 U3.8(VCC)
NetR6_2: R6.2 U3.7(RST/SIO3)
NetR7_2: R7.2 U3.6(SCLK)
NetR8_2: R8.2 U3.5(SI/SIO0)
NetR26_2: R26.2 R27.1 U3.1(~{CS})
NetR28_2: R28.2 U3.2(SO/SIO1)
NetR29_2: R29.2 U3.3(~{WP}/SIO2)

### Notes on the sheet
- PB11
- PA3
- PB0
- PB1
- PA6
- PA7
- Title:
- Project:
- Size:
- Revision:
- Variant:
- A4
- -
- Date:
- Reference:
- Sheet:
- of

### Library data of the parts
C4 = Cap: as C15 on sheet PSRAM; Published: 8-Jun-2000; Revision: July-2002: Re-released for DXP Platform.; Publisher: Altium Limited; Manuf_1: YAGEO; Manuf_Part_1: CC0603KRX7R7BB104
R6-R8 R26 R28 R29 = res1: Resistor, 22 ,0603,1%,YAGEO; Ordered by: Subcon; ECCN_US/EU: NA; Published: 8-Jun-2000; Revision: July-2002: Re-released for DXP Platform.; Publisher: Altium Limited; Manuf_1: YAGEO; Manuf_Part_1: RC0603JR-0722RL
R27 = res1: Resistor,10K,0603,1%,YAGEO; Ordered by: Subcon; ECCN_US/EU: NA; Published: 8-Jun-2000; Revision: July-2002: Re-released for DXP Platform.; Publisher: Altium Limited; Manuf_1: YAGEO; Manuf_Part_1: RC0603FR-0710KL
SB3 = SB_ON: as SB12 on sheet PSRAM; Revision: July-2002: Re-released for DXP Platform.; ECCN_US/EU: N/A
U3 = MX25R6435FM2IL0: Ultra Low Power 64M-BIT CMOS MXSMIO FLASH MEMORY; Manuf_1: MXIC; Ordered by: Subcon; Manuf_Part_1: MX25R6435FM2IL0

## Sheet ST_LINK_V2-1_2.SCHDOC: ST-LINK/V2-1
size A3; Author: P.A.; CompanyName: STMicroelectronics; Organization: Microcontrollers Division; Address1: 12, Rue Jules HOROWITZ; Address2: 38019 Grenoble; Address3: FRANCE; DocumentNumber: MB1261; Revision: B.01; SheetNumber: 5; SheetTotal: 15; Project: STM32L496G-DISCO
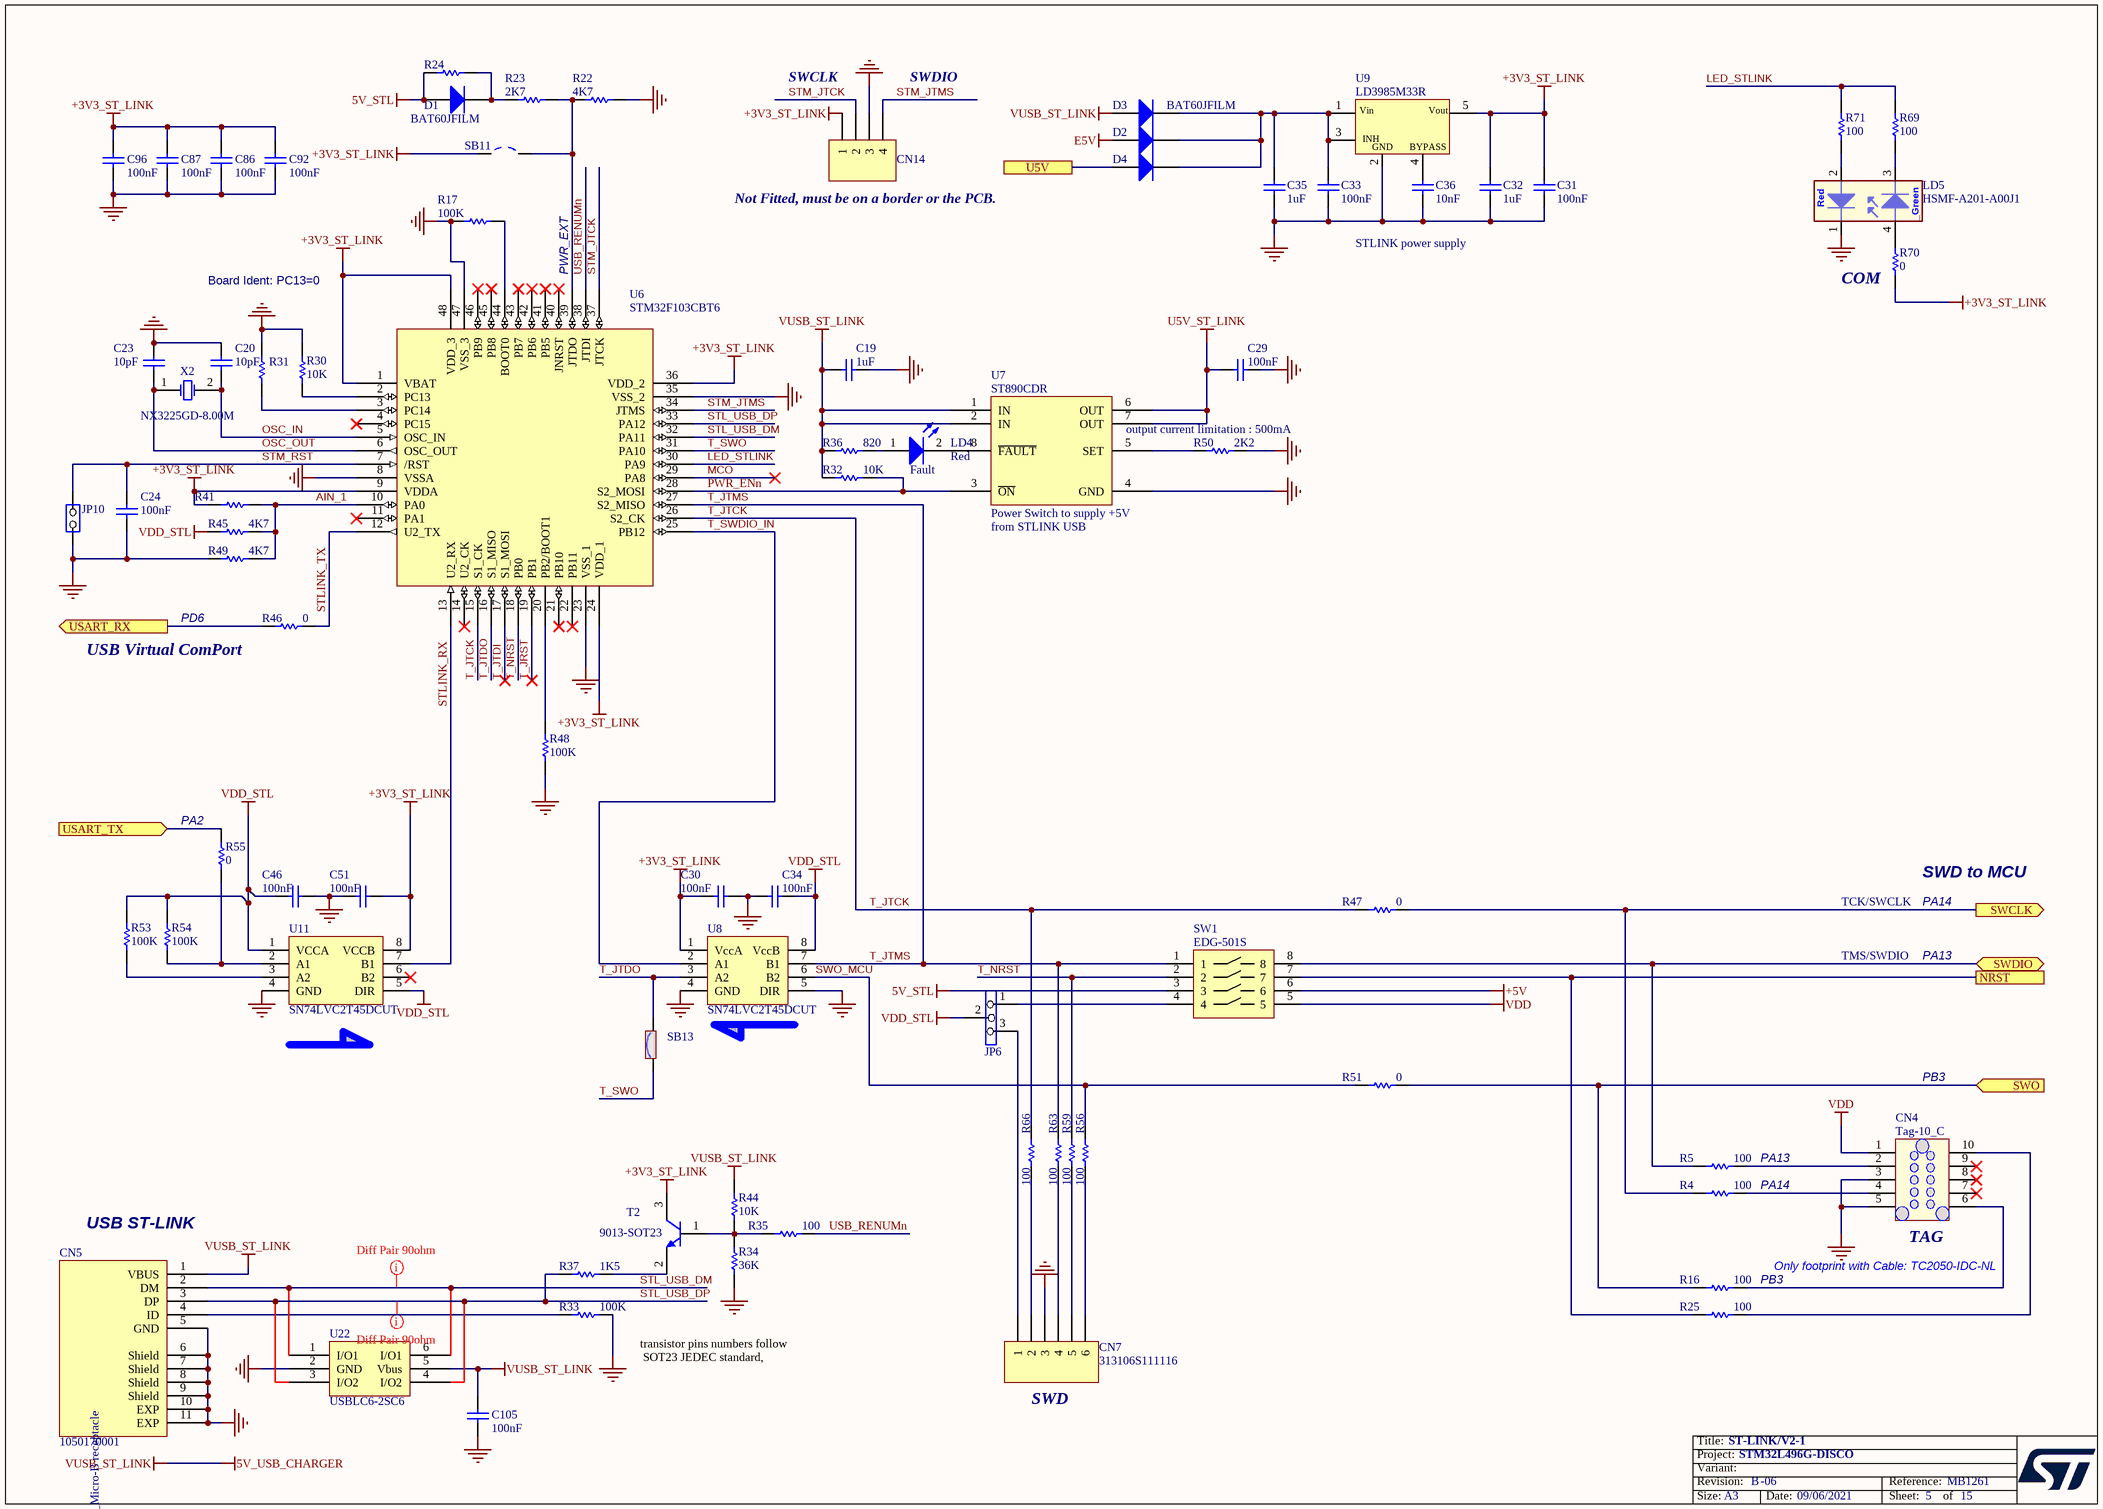
[diagram p11: ST_LINK_V2-1_2.SCHDOC]

### Parts
C19  value 1uF  [0603C]  (hidden comment: CC0603KRX5R7BB105)
C20  value 10pF  [0603C]  (hidden comment: CC0603JRNPO9BN100)
C23  value 10pF  [0603C]  (hidden comment: CC0603JRNPO9BN100)
C24  value 100nF  [0603C]  (hidden comment: CC0603KRX7R7BB104)
C29  value 100nF  [0603C]  (hidden comment: CC0603KRX7R7BB104)
C30  value 100nF  [0603C]  (hidden comment: CC0603KRX7R7BB104)
C31  value 100nF  [0603C]  (hidden comment: CC0603KRX7R7BB104)
C32  value 1uF  [0603C]  (hidden comment: CC0603KRX5R7BB105)
C33  value 100nF  [0603C]  (hidden comment: CC0603KRX7R7BB104)
C34  value 100nF  [0603C]  (hidden comment: CC0603KRX7R7BB104)
C35  value 1uF  [0603C]  (hidden comment: CC0603KRX5R7BB105)
C36  value 10nF  [0603C]  (hidden comment: CC0603KRX7R9BB103)
C46  value 100nF  [0603C]  (hidden comment: CC0603KRX7R7BB104)
C51  value 100nF  [0603C]  (hidden comment: CC0603KRX7R7BB104)
C86  value 100nF  [0603C]  (hidden comment: CC0603KRX7R7BB104)
C87  value 100nF  [0603C]  (hidden comment: CC0603KRX7R7BB104)
C92  value 100nF  [0603C]  (hidden comment: CC0603KRX7R7BB104)
C96  value 100nF  [0603C]  (hidden comment: CC0603KRX7R7BB104)
C105  value 100nF  [0603C]  (hidden comment: CC0603KRX7R7BB104)
CN4  Tag-10_C  [TC2050-IDC-NL]
CN5  1050170001  [MICRO_USB_B_105017]
CN7  313106S111116  [HDR_1X6_2R54_W]
CN14  (no value)  [HDR_1X4_2R54]
D1  BAT60JFILM  [SOD-323]
D2  (no value)  [SOD-323]
D3  BAT60JFILM  [SOD-323]
D4  (no value)  [SOD-323]
JP6  3 PIN Jumper  [SIP3]  (value not drawn)
JP10  (no value)  [SIP2]
LD4  Silkscreen: Fault  Corlor: Red  [0603D]  (hidden comment: 19-217/R6C-AL1M2VY/3T)
LD5  HSMF-A201-A00J1  [LED2_3528]
R4  value 100  [0603R]  (hidden comment: RC0603JR-07100RL)
R5  value 100  [0603R]  (hidden comment: RC0603JR-07100RL)
R16  value 100  [0603R]  (hidden comment: RC0603JR-07100RL)
R17  value 100K  [0603R]  (hidden comment: RC0603FR-07100KL)
R22  value 4K7  [0603R]  (hidden comment: RC0603FR-074K7L)
R23  value 2K7  [0603R]  (hidden comment: RC0603FR-072K7L)
R24  (no value)  [0603R]
R25  value 100  [0603R]  (hidden comment: RC0603JR-07100RL)
R30  value 10K  [0603R]  (hidden comment: RC0603FR-0710KL)
R31  (no value)  [0603R]
R32  value 10K  [0603R]  (hidden comment: RC0603FR-0710KL)
R33  value 100K  [0603R]  (hidden comment: RC0603FR-07100KL)
R34  value 36K  [0603R]  (hidden comment: RC0603FR-0736KL)
R35  value 100  [0603R]  (hidden comment: RC0603JR-07100RL)
R36  820  [0603R]
R37  value 1K5  [0603R]  (hidden comment: RC0603FR-071K5L)
R41  (no value)  [0603R]
R44  value 10K  [0603R]  (hidden comment: RC0603FR-0710KL)
R45  value 4K7  [0603R]  (hidden comment: RC0603FR-074K7L)
R46  value 0  [0603R]  (hidden comment: RC0603JR-070RL)
R47  value 0  [0603R]  (hidden comment: RC0603JR-070RL)
R48  value 100K  [0603R]  (hidden comment: RC0603FR-07100KL)
R49  value 4K7  [0603R]  (hidden comment: RC0603FR-074K7L)
R50  value 2K2  [0603R]  (hidden comment: RC0603FR-072K2L)
R51  value 0  [0603R]  (hidden comment: RC0603JR-070RL)
R53  value 100K  [0603R]  (hidden comment: RC0603FR-07100KL)
R54  value 100K  [0603R]  (hidden comment: RC0603FR-07100KL)
R55  value 0  [0603R]  (hidden comment: RC0603JR-070RL)
R56  value 100  [0603R]  (hidden comment: RC0603JR-07100RL)
R59  value 100  [0603R]  (hidden comment: RC0603JR-07100RL)
R63  value 100  [0603R]  (hidden comment: RC0603JR-07100RL)
R66  value 100  [0603R]  (hidden comment: RC0603JR-07100RL)
R69  value 100  [0603R]  (hidden comment: RC0603JR-07100RL)
R70  value 0  [0603R]  (hidden comment: RC0603JR-070RL)
R71  value 100  [0603R]  (hidden comment: RC0603JR-07100RL)
SB11  Solder Bridge OFF  [SB_0603]  (value not drawn)
SB13  Solder Bridge ON  [SB_0603]  (value not drawn)
SW1  EDG-501S  [SW1_11R7X9R7-12R2X9R65-HDR_CPT]
T2  9013-SOT23  [SOT-23]
U6  STM32F103CBT6  [LQFP48_0R5_9X9]
U7  ST890CDR  [SOIC8_1R27_4R9X6]
U8  SN74LVC2T45DCUT  [USOP8_0R5_2X3R1]
U9  LD3985M33R  [SOT23-5]
U11  SN74LVC2T45DCUT  [USOP8_0R5_2X3R1]
U22  USBLC6-2SC6  [SOT23-6L]
X2  NX3225GD-8.00M  [XTAL_2SM_3R2X2R5]

### Ports
NRST, SWCLK (out), SWDIO (bidir), SWO (in), U5V, USART_RX (out), USART_TX (in)

### Nets
5V_STL: D1.1(A) R24.2 SW1.3
5V_USB_CHARGER: C19.2 C105.1 CN5.1(VBUS) D3.1(A) R32.1 R36.2 R44.1 U7.1(IN) U7.2(IN) U22.5(Vbus)  [also labelled VUSB_ST_LINK]
+3V3_ST_LINK: C30.2 C31.1 C32.1 C51.2 C86.1 C87.1 C92.1 C96.1 CN14.1 R41.1 R70.1 SB11.1 T2.3(C) U6.1(VBAT) U6.9(VDDA) U6.24(VDD_1) U6.36(VDD_2) U6.48(VDD_3) U8.1(VccA) U9.5(Vout) U11.8(VCCB)
+5V: SW1.6
E5V: D2.1(A)
GND: C19.1 C20.1 C23.1 C24.2 C29.1 C30.1 C31.2 C32.2 C33.2 C34.2 C35.2 C36.2 C46.2 C51.1 C86.2 C87.2 C92.2 C96.2 C105.2 CN4.3 CN4.5 CN5.5(GND) CN5.6(Shield) CN5.7(Shield) CN5.8(Shield) CN5.9(Shield) CN5.10(EXP) CN5.11(EXP) CN7.3 CN14.3 JP10.2(NO) LD5.1 R17.2 R22.1 R30.1 R31.1 R33.1 R34.2 R48.1 R49.2 R50.1 U6.8(VSSA) U6.23(VSS_1) U6.35(VSS_2) U6.47(VSS_3) U7.4(GND) U8.4(GND) U8.5(DIR) U9.2(GND) U11.4(GND) U22.2(GND)
U5V_ST_LINK: C29.2 U7.6(OUT) U7.7(OUT)
VDD: CN4.1 SW1.5
VDD_STL: C34.1 C46.1 JP6.2 R45.2 R53.2 R54.2 U8.8(VccB) U11.1(VCCA) U11.5(DIR)
AIN_1: R41.2 R45.1 R49.1 U6.10(PA0)
LED_STLINK: R69.1 R71.1 U6.30(PA9)
MCO: U6.29(PA8)
NRST: R25.2 SW1.7 ; port NRST
OSC_IN: C20.2 U6.5(OSC_IN) X2.2(OSC2)
OSC_OUT: C23.2 U6.6(OSC_OUT) X2.1(OSC1)
PWR_ENn: R32.2 U6.28(S2_MOSI) U7.3(~{ON})
STL_USB_DM: CN5.2(DM) U6.32(PA11) U22.1(I/O1) U22.6(I/O1)
STL_USB_DP: CN5.3(DP) R37.2 U6.33(PA12) U22.3(I/O2) U22.4(I/O2)
STLINK_RX: U6.13(U2_RX) U11.7(B1)
STLINK_TX: R46.1 U6.12(U2_TX)
STM_JTCK: CN14.2 U6.37(JTCK)
STM_JTMS: CN14.4 U6.34(JTMS)
STM_RST: C24.1 JP10.1(COMMON) U6.7(/RST)
SWCLK: R4.2 R47.1 ; port SWCLK
SWDIO: R5.2 SW1.8 ; port SWDIO
SWO: R16.2 R51.1 ; port SWO
SWO_MCU: R51.2 R56.2 U8.6(B2)
T_JRST: U6.19(PB1)
T_JTCK: R47.2 R66.2 U6.15(S1_CK) U6.26(S2_CK)
T_JTDI: U6.17(S1_MOSI)
T_JTDO: SB13.2 U6.16(S1_MISO) U8.3(A2)
T_JTMS: R63.2 SW1.1 U6.27(S2_MISO) U8.7(B1)
T_NRST: R59.2 SW1.2 U6.18(PB0)
T_SWDIO_IN: U6.25(PB12) U8.2(A1)
T_SWO: SB13.1 U6.31(PA10)
USART2_RX: R46.2 ; port USART_RX
USART2_TX: R55.1 ; port USART_TX
USB_OTGFS_VBUS: D4.1(A) ; port U5V
USB_RENUMn: R35.2 U6.38(JTDI)
NetC33_1: C33.1 C35.1 D2.2(K) D3.2(K) D4.2(K) U9.1(Vin) U9.3(CE)
NetC36_1: C36.1 U9.4(BYPASS)
NetCN4_2: CN4.2 R5.1
NetCN4_4: CN4.4 R4.1
NetCN4_6: CN4.6 R16.1
NetCN4_10: CN4.10 R25.1
NetCN5_4: CN5.4(ID) R33.2
NetCN7_1: CN7.1 JP6.3
NetCN7_2: CN7.2 R66.1
NetCN7_4: CN7.4 R63.1
NetCN7_5: CN7.5 R59.1
NetCN7_6: CN7.6 R56.1
NetD1_2: D1.2(K) R23.2 R24.1
NetJP6_1: JP6.1 SW1.4
NetLD4_1: LD4.1(A) R36.1
NetLD4_2: LD4.2(K) U7.8(~{FAULT})
NetLD5_2: LD5.2 R71.2
NetLD5_3: LD5.3 R69.2
NetLD5_4: LD5.4 R70.2
NetR17_1: R17.1 U6.44(BOOT0)
NetR22_2: R22.2 R23.1 SB11.2 U6.39(JTDO)
NetR30_2: R30.2 U6.2(PC13)
NetR31_2: R31.2 U6.3(PC14)
NetR34_1: R34.1 R35.1 R44.2 T2.1(B)
NetR37_1: R37.1 T2.2(E)
NetR48_2: R48.2 U6.20(PB2/BOOT1)
NetR50_2: R50.2 U7.5(SET)
NetR53_1: R53.1 U11.3(A2)
NetR54_1: R54.1 R55.2 U11.2(A1)

Not connected (* = marked no-connect by the designer): CN4 7* 8* 9*; U6 4(PC15)* 11(PA1)* 14(U2_CK)* 21(PB10)* 22(PB11)* 40(JNRST)* 41(PB5)* 42(PB6)* 43(PB7)* 45(PB8)* 46(PB9)*; U11 6(B2)*

### Layout directives
mark named Diff Pair 90ohm: STL_USB_DM, STL_USB_DP

### Notes on the sheet
- SWCLK
- SWDIO
- (near CN14) Not Fitted, must be on a border or the PCB.
- Board Ident: PC13=0
- PWR_EXT
- STLINK power supply
- (near R70) COM
- output current limitation : 500mA
- (near U7) Power Switch to supply +5V from STLINK USB
- PD6
- (near R46) USB Virtual ComPort
- (near R55) PA2
- TCK/SWCLK
- SWD to MCU
- PA14
- TMS/SWDIO
- PA13
- PB3
- (near CN5) USB ST-LINK
- (near CN4) TAG
- Only footprint with Cable: TC2050-IDC-NL
- transistor pins numbers follow
  SOT23 JEDEC standard,
- (near CN7) SWD
- Title:
- Project:
- Size:
- Revision:
- Variant:
- A3
- -
- Date:
- Reference:
- Sheet:
- of
- (in symbol 1050170001) USB_Micro-B receptacle
- (in symbol LD3985M33R) INH
- (in symbol LD_BICOLOR_CMS) Red; _Green

### Library data of the parts
C19 C32 C35 = Cap: Capacitor,1uF,0603,16V,10%,X5R,YAGEO; Ordered by: Subcon; Published: 8-Jun-2000; Revision: July-2002: Re-released for DXP Platform.; Publisher: Altium Limited; Manuf_1: YAGEO; Manuf_Part_1: CC0603KRX5R7BB105
C20 C23 = Cap: Capacitor,10pF,5%,50V,NPO,0603,YAGEO; Ordered by: Subcon; Published: 8-Jun-2000; Revision: July-2002: Re-released for DXP Platform.; Publisher: Altium Limited; Manuf_1: YAGEO; Manuf_Part_1: CC0603JRNPO9BN100
C24 C29-C31 C33 C34 C46 C51 C86 C87 C92 C96 C105 = Cap: as C15 on sheet PSRAM; Published: 8-Jun-2000; Revision: July-2002: Re-released for DXP Platform.; Publisher: Altium Limited; Manuf_1: YAGEO; Manuf_Part_1: CC0603KRX7R7BB104
C36 = Cap: Capacitor,10nF,0603,50V,10%,X7R,YAGEO;; Ordered by: Subcon; Published: 8-Jun-2000; Revision: July-2002: Re-released for DXP Platform.; Publisher: Altium Limited; Manuf_1: YAGEO; Manuf_Part_1: CC0603KRX7R9BB103
CN4 = Tag-10_C: Footprint for TC2050-IDC-430 plug of nails (TM) cable for MP430; Manuf_1: None; Revision: 17-Jul-2002: Re-released for DXP Platform.; Manuf_Part_1: None
CN5 = 1050170001: Manuf_1: MOLEX; Silkscreen: USB; Ordered by: Subcon; ECCN_US/EU: NA; Manuf_Part_1: 1050170001
CN7 = Header 6: Header, 6-Pin; Manuf_1: lyconn; Ordered by: Subcon; Silkscreen: SWD; ECCN_US/EU: NA; LatestRevisionDate: 17-Jul-2002; LatestRevisionNote: Re-released for DXP Platform.; Publisher: Altium Limited; Manuf_Part_1: 313106S111116
CN14 = Header 4: Header, 4-Pin; ECCN_US/EU: [N/A]; Revision: 17-Jul-2002: Re-released for DXP Platform.; Publisher: Altium Limited; SOFER_FP: HDR_1X4_2R54
D1-D4 = BAT60JFILM: Provided: STM; ECCN_US/EU: EAR99/NEC; Ref St: 9151097; Revision: July-2002: Re-released for DXP Platform.; Order: BAT60JFILM; Manuf_Part_1: BAT60JFILM; Manuf_1: STM; Ordered by: STM
  D1-D3: Distrib: ST
  D4: Distrib: STM
JP6 = Jumper3: Manuf_1: lyconn; Manuf_Part_1: 313103S111116; Ordered by: Subcon
JP10 = JP2: as JP8 on sheet Power
LD4 = LED2: LED, Red ,0603; Manuf_1: Everlight; Ordered by: Subcon; ECCN_US/EU: EAR99/NEC; Published: 8-Jun-2000; Revision: July-2002: Re-released for DXP Platform.; Publisher: Altium Limited; Manuf_Part_1: 19-217/R6C-AL1M2VY/3T
LD5 = LD_BICOLOR_CMS: Bicolor Led; Manuf_1: Avago Technologies; Manuf_2: everluck; Manuf_Part_2: LE-RGW35280; ECCN_US/EU: EAR99/NEC; Silkscreen: COM; Ordered by: Subcon; Distrib: RADIOSPARES; Manuf_Part_1: HSMF-A201-A00J1; Footprint: HSMF-A201
R4 R5 R16 R25 R35 R56 R59 R63 R66 R69 R71 = res1: Resistor, 100 ,0603,1%,YAGEO; Ordered by: Subcon; ECCN_US/EU: NA; Published: 8-Jun-2000; Revision: July-2002: Re-released for DXP Platform.; Publisher: Altium Limited; Manuf_1: YAGEO; Manuf_Part_1: RC0603JR-07100RL
R17 R33 R48 R53 R54 = res1: as R13-R15 on sheet PSRAM; Published: 8-Jun-2000; Revision: July-2002: Re-released for DXP Platform.; Publisher: Altium Limited; Manuf_1: YAGEO; Manuf_Part_1: RC0603FR-07100KL
R22 R45 R49 = res1: Resistor,4.7K,0603,1%,YAGEO; Ordered by: Subcon; ECCN_US/EU: NA; Published: 8-Jun-2000; Revision: July-2002: Re-released for DXP Platform.; Publisher: Altium Limited; Manuf_1: YAGEO; Manuf_Part_1: RC0603FR-074K7L
R23 = res1: Resistor,2.7K,0603,1%,YAGEO; Ordered by: Subcon; ECCN_US/EU: NA; Published: 8-Jun-2000; Revision: July-2002: Re-released for DXP Platform.; Publisher: Altium Limited; Manuf_1: YAGEO; Manuf_Part_1: RC0603FR-072K7L
R24 = Res_0_5%_0402: Resistor,0,0603,5%,YAGEO; Manuf_Part_1: RC0603JR-070RL; Value: 0Ohm; ECCN_US/EU: [N/A]; Ordered by: Subcon; Manuf_1: YAGEO; Distrib: FARNELL
R30 R32 R44 = res1: as R27 on sheet QSPI; Published: 8-Jun-2000; Revision: July-2002: Re-released for DXP Platform.; Publisher: Altium Limited; Manuf_1: YAGEO; Manuf_Part_1: RC0603FR-0710KL
R31 R41 = res1: Resistor,100K,0603,1%,YAGEO; Manuf_Part_1: RC0603FR-07100KL; Ordered by: Subcon; ECCN_US/EU: [N/A]; Published: 8-Jun-2000; Revision: July-2002: Re-released for DXP Platform.; Publisher: Altium Limited; Value: 100K; Manuf_1: YAGEO
R34 = res1: Resistor,36K,0603,1%,YAGEO; Ordered by: Subcon; ECCN_US/EU: NA; Published: 8-Jun-2000; Revision: July-2002: Re-released for DXP Platform.; Publisher: Altium Limited; Manuf_1: YAGEO; Manuf_Part_1: RC0603FR-0736KL
R36 = res1: as R68 on sheet Power; Published: 8-Jun-2000; Revision: July-2002: Re-released for DXP Platform.; Publisher: Altium Limited; Value: 820
R37 = res1: Resistor,1.5K,0603,1%,YAGEO; Ordered by: Subcon; ECCN_US/EU: NA; Published: 8-Jun-2000; Revision: July-2002: Re-released for DXP Platform.; Publisher: Altium Limited; Manuf_1: YAGEO; Manuf_Part_1: RC0603FR-071K5L
R46 R47 R51 R55 R70 = res1: as R129 on sheet PSRAM; Published: 8-Jun-2000; Revision: July-2002: Re-released for DXP Platform.; Publisher: Altium Limited; Manuf_1: YAGEO; Manuf_Part_1: RC0603JR-070RL
R50 = res1: Resistor,2.2K,0603,1%,YAGEO; Ordered by: Subcon; ECCN_US/EU: NA; Published: 8-Jun-2000; Revision: July-2002: Re-released for DXP Platform.; Publisher: Altium Limited; Manuf_1: YAGEO; Manuf_Part_1: RC0603FR-072K2L
SB11 = SB_OFF: Solder: NO; Revision: July-2002: Re-released for DXP Platform.; ECCN_US/EU: N/A
SB13 = SB_ON: as SB12 on sheet PSRAM; Revision: July-2002: Re-released for DXP Platform.; ECCN_US/EU: N/A
SW1 = EDG-501S: Gold Plated Contacts,4PST,1x4 Switch; Manuf_1: Grayhill Inc; Ordered by: Subcon; Second Source: NDS-04-V; Manuf_Part_1: EDG-501S
T2 = NPN: NPN Bipolar Transistor; Manuf_Part_1: MMBT9013; Code - JEDEC: TO-226-AA; Ordered by: Subcon; ECCN_US/EU: EAR99/NEC; Published: 8-Jun-2000; Revision: July-2002: Re-released for DXP Platform.; Publisher: Altium Limited
U6 = STM32F10x(48pin): IC,STM32F103CBT6,LQFP-48; Ordered by: STM; ECCN_US/EU: 3A991A2/NEC; Ref St: 9175111; Distrib: ST; Manuf_1: STM; Manuf_Part_1: STM32F103CBT6
U7 = ST890CDR: Manuf_1: ST; Ordered by: STM; Manuf_Part_1: ST890CDR
U8 U11 = SN74LVC2T45DCUT: Manuf_1: TI; Ordered by: Subcon; ECCN_US/EU: EAR99/NEC; Manuf_Part_1: SN74LVC2T45DCUT
U9 = LD3985M33R: Ultra low drop-low noise BiCMOS voltage, regulators low ESR capacitors compatible; Manuf_1: STM; Manuf_Part_2: LDK120DM33R; Ref St: 9176161; ECCN_US/EU: EAR99/NEC; Manuf_Part_1: LD3985M33R; Provided: STM; Distrib: STM; Order: LD3985M33R; Ordered by: STM; Manuf_2: STM
U22 = USBLC6-2SC6: Manuf_1: STM; Manuf_Part_1: USBLC6-2SC6; Ordered by: STM
X2 = XTAL_8M_NX3225GD: Crystal 8Mhz, 8pF, -+50PPM, SMD; Manuf_1: NDK; Manuf_Part_1: NX3225GD 8MHz EXS00A-CG04874; Manuf_Part_2: NX3225GD-8.000M-STD-CRA-3; ECCN_US/EU: EAR99/NEC; NDK Ref: X3127326; Ref St: 9157029; Provided: ST; Ordered by: STM; Order: NX3225GD 8MHz EXS00A-CG04874

## Sheet USB_OTG_FS.SchDoc: USB_OTG_FS
size A4; Author: P.A.; CompanyName: STMicroelectronics; Organization: Microcontrollers Division; Address1: 12, Rue Jules HOROWITZ; Address2: 38019 Grenoble; Address3: FRANCE; DocumentNumber: MB1261; Revision: B.01; SheetNumber: 8; SheetTotal: 15; Project: STM32L496G-DISCO
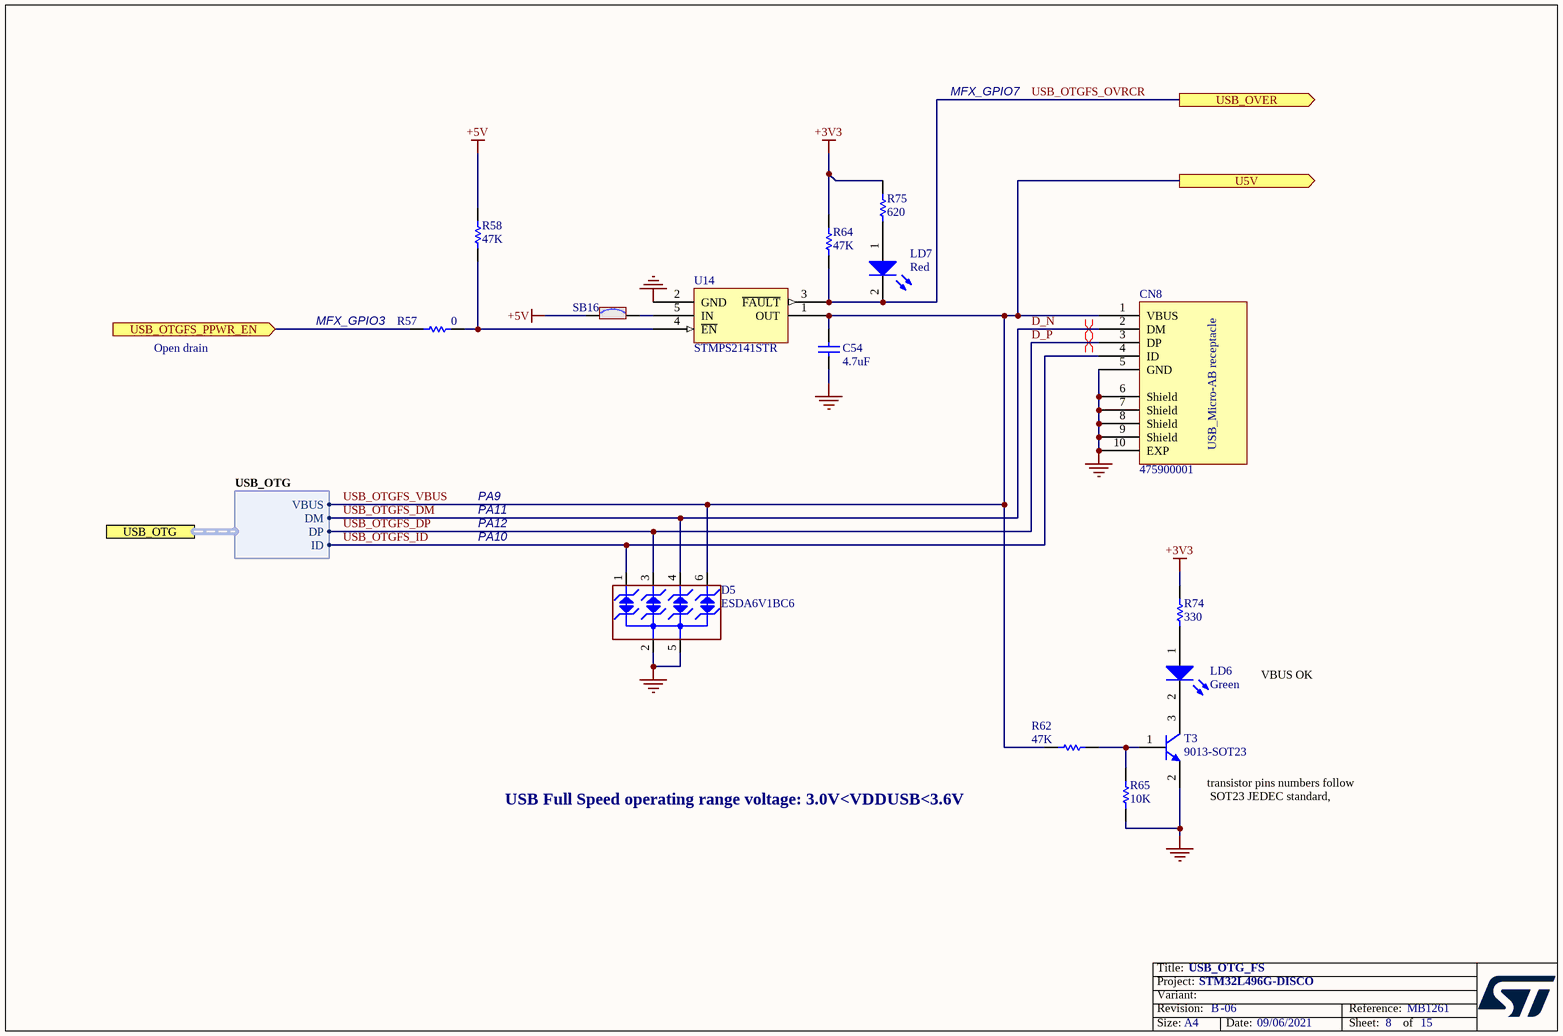
[diagram p12: USB_OTG_FS.SchDoc]

### Parts
C54  value 4.7uF  [0603C]  (hidden comment: CC0603KRX5R7BB475)
CN8  475900001  [MOLEX_47590001]
D5  ESDA6V1BC6  [SOT23-6L]
LD6  Corlor: Green  [0603D]  (hidden comment: 19-213SY6C/S530-E2/TR8LED)
LD7  Corlor: Red  [0603D]  (hidden comment: 19-217/R6C-AL1M2VY/3T)
R57  value 0  [0603R]  (hidden comment: RC0603JR-070RL)
R58  value 47K  [0603R]  (hidden comment: RC0603JR-0747KL)
R62  value 47K  [0603R]  (hidden comment: RC0603JR-0747KL)
R64  value 47K  [0603R]  (hidden comment: RC0603JR-0747KL)
R65  value 10K  [0603R]  (hidden comment: RC0603JR-0710KL)
R74  value 330  [0603R]  (hidden comment: RC0603JR-07330RL)
R75  value 620  [0603R]  (hidden comment: RC0603JR-07620RL)
SB16  Solder Bridge ON  [SB_0603]  (value not drawn)
T3  9013-SOT23  [SOT-23]
U14  STMPS2141STR  [SOT23-5]

### Ports
U5V (out), USB_OTG (harness USB_OTG), USB_OTGFS_PPWR_EN (in), USB_OVER (out)

### Harnesses
USB_OTG: VBUS, DM, DP, ID

### Nets
+3V3: R64.1 R74.1 R75.1  [project net 3V3_OUT]
+5V: R58.1 SB16.1
GND: C54.2 CN8.5(GND) CN8.6(Shield) CN8.7(Shield) CN8.8(Shield) CN8.9(Shield) CN8.10(EXP) D5.2(IO2) D5.5(IO4) R65.1 T3.2(E) U14.2(GND)
D_N: CN8.2(DM) D5.4(IO3) ; port USB_OTG.DM  [also labelled USB_OTGFS_DM]
D_P: CN8.3(DP) D5.3(GND) ; port USB_OTG.DP  [also labelled USB_OTGFS_DP]
USB_OTGFS_ID: CN8.4(ID) D5.1(IO1) ; port USB_OTG.ID
USB_OTGFS_OVRCR: LD7.2(K) R64.2 U14.3(~{FAULT}) ; port USB_OVER
USB_OTGFS_VBUS: C54.1 CN8.1(VBUS) D5.6(NC) R62.1 U14.1(OUT) ; port U5V, port USB_OTG.VBUS
NetLD6_1: LD6.1(A) R74.2
NetLD6_2: LD6.2(K) T3.3(C)
NetLD7_1: LD7.1(A) R75.2
NetR57_1: R57.1 R58.2 U14.4(~{EN})
NetR57_2: R57.2 ; port USB_OTGFS_PPWR_EN
NetR62_2: R62.2 R65.2 T3.1(B)
NetSB16_2: SB16.2 U14.5(IN)

### Layout directives
differential pair: D_N, D_P

### Notes on the sheet
- MFX_GPIO7
- Open drain
- (near R57) MFX_GPIO3
- PA9
- PA11
- PA10
- PA12
- VBUS OK
- USB Full Speed operating range voltage: 3.0V<VDDUSB<3.6V
- (near T3) transistor pins numbers follow
  SOT23 JEDEC standard,
- Title:
- Project:
- Size:
- Revision:
- Variant:
- A4
- -
- Date:
- Reference:
- Sheet:
- of
- (in symbol 475900001) USB_Micro-AB receptacle

### Library data of the parts
C54 = Cap: Capacitor,4.7uF,16V, X5R,10%,0603; Manuf_1: YAGEO; Ordered by: Subcon; Published: 8-Jun-2000; Revision: July-2002: Re-released for DXP Platform.; Publisher: Altium Limited; Manuf_Part_1: CC0603KRX5R7BB475
CN8 = 475900001: Manuf_1: MOLEX; Ordered by: Subcon; Silkscreen: USB_USER; ECCN_US/EU: NA; Manuf_Part_1: 475900001
D5 = ESDA6V1BC6: 4-line ESD protection; Manuf_1: STM; Manuf_Part_1: ESDA5V3L; Ref St: 9179034; Provided: ST; ECCN_US/EU: EAR99/NEC; Distrib: ST; Order: ESDA5V3L; Ordered by: STM
LD6 = LED2: as LD8 on sheet Power; Published: 8-Jun-2000; Revision: July-2002: Re-released for DXP Platform.; Publisher: Altium Limited; Manuf_Part_1: 19-213SY6C/S530-E2/TR8LED
LD7 = LED2: as LD4 on sheet ST_LINK_V2-1_2; Published: 8-Jun-2000; Revision: July-2002: Re-released for DXP Platform.; Publisher: Altium Limited; Manuf_Part_1: 19-217/R6C-AL1M2VY/3T
R57 = res1: as R129 on sheet PSRAM; Published: 8-Jun-2000; Revision: July-2002: Re-released for DXP Platform.; Publisher: Altium Limited; Manuf_1: YAGEO; Manuf_Part_1: RC0603JR-070RL
R58 R62 R64 = res1: Resistor, 47K,0603,1%,YAGEO; Ordered by: Subcon; ECCN_US/EU: NA; Published: 8-Jun-2000; Revision: July-2002: Re-released for DXP Platform.; Publisher: Altium Limited; Manuf_1: YAGEO; Manuf_Part_1: RC0603JR-0747KL
R65 = res1: Resistor, 10K,0603,1%,YAGEO; Ordered by: Subcon; ECCN_US/EU: NA; Published: 8-Jun-2000; Revision: July-2002: Re-released for DXP Platform.; Publisher: Altium Limited; Manuf_1: YAGEO; Manuf_Part_1: RC0603JR-0710KL
R74 = res1: Resistor, 330R , 0603,1%,YAGEO; Ordered by: Subcon; ECCN_US/EU: NA; Published: 8-Jun-2000; Revision: July-2002: Re-released for DXP Platform.; Publisher: Altium Limited; Manuf_1: YAGEO; Manuf_Part_1: RC0603JR-07330RL
R75 = res1: Resistor, 620R , 0603,1%,YAGEO; Ordered by: Subcon; ECCN_US/EU: NA; Published: 8-Jun-2000; Revision: July-2002: Re-released for DXP Platform.; Publisher: Altium Limited; Manuf_1: YAGEO; Manuf_Part_1: RC0603JR-07620RL
SB16 = SB_ON: as SB12 on sheet PSRAM; Revision: July-2002: Re-released for DXP Platform.; ECCN_US/EU: N/A
T3 = NPN: as T2 on sheet ST_LINK_V2-1_2; Published: 8-Jun-2000; Revision: July-2002: Re-released for DXP Platform.; Publisher: Altium Limited
U14 = STMPS2141STR: Enhanced single channel power switches; Provided: ST; ECCN_US/EU: EAR99/NEC; Ref St: 9159003; Ordered by: STM; Order: STMPS2141STR; Manuf_Part_1: STMPS2141STR; Manuf_1: ST; Distrib: ST